# EAGLE board M.2 SoM breakout board v0.5 (EAGLE 9.6.2), part 1 of 2
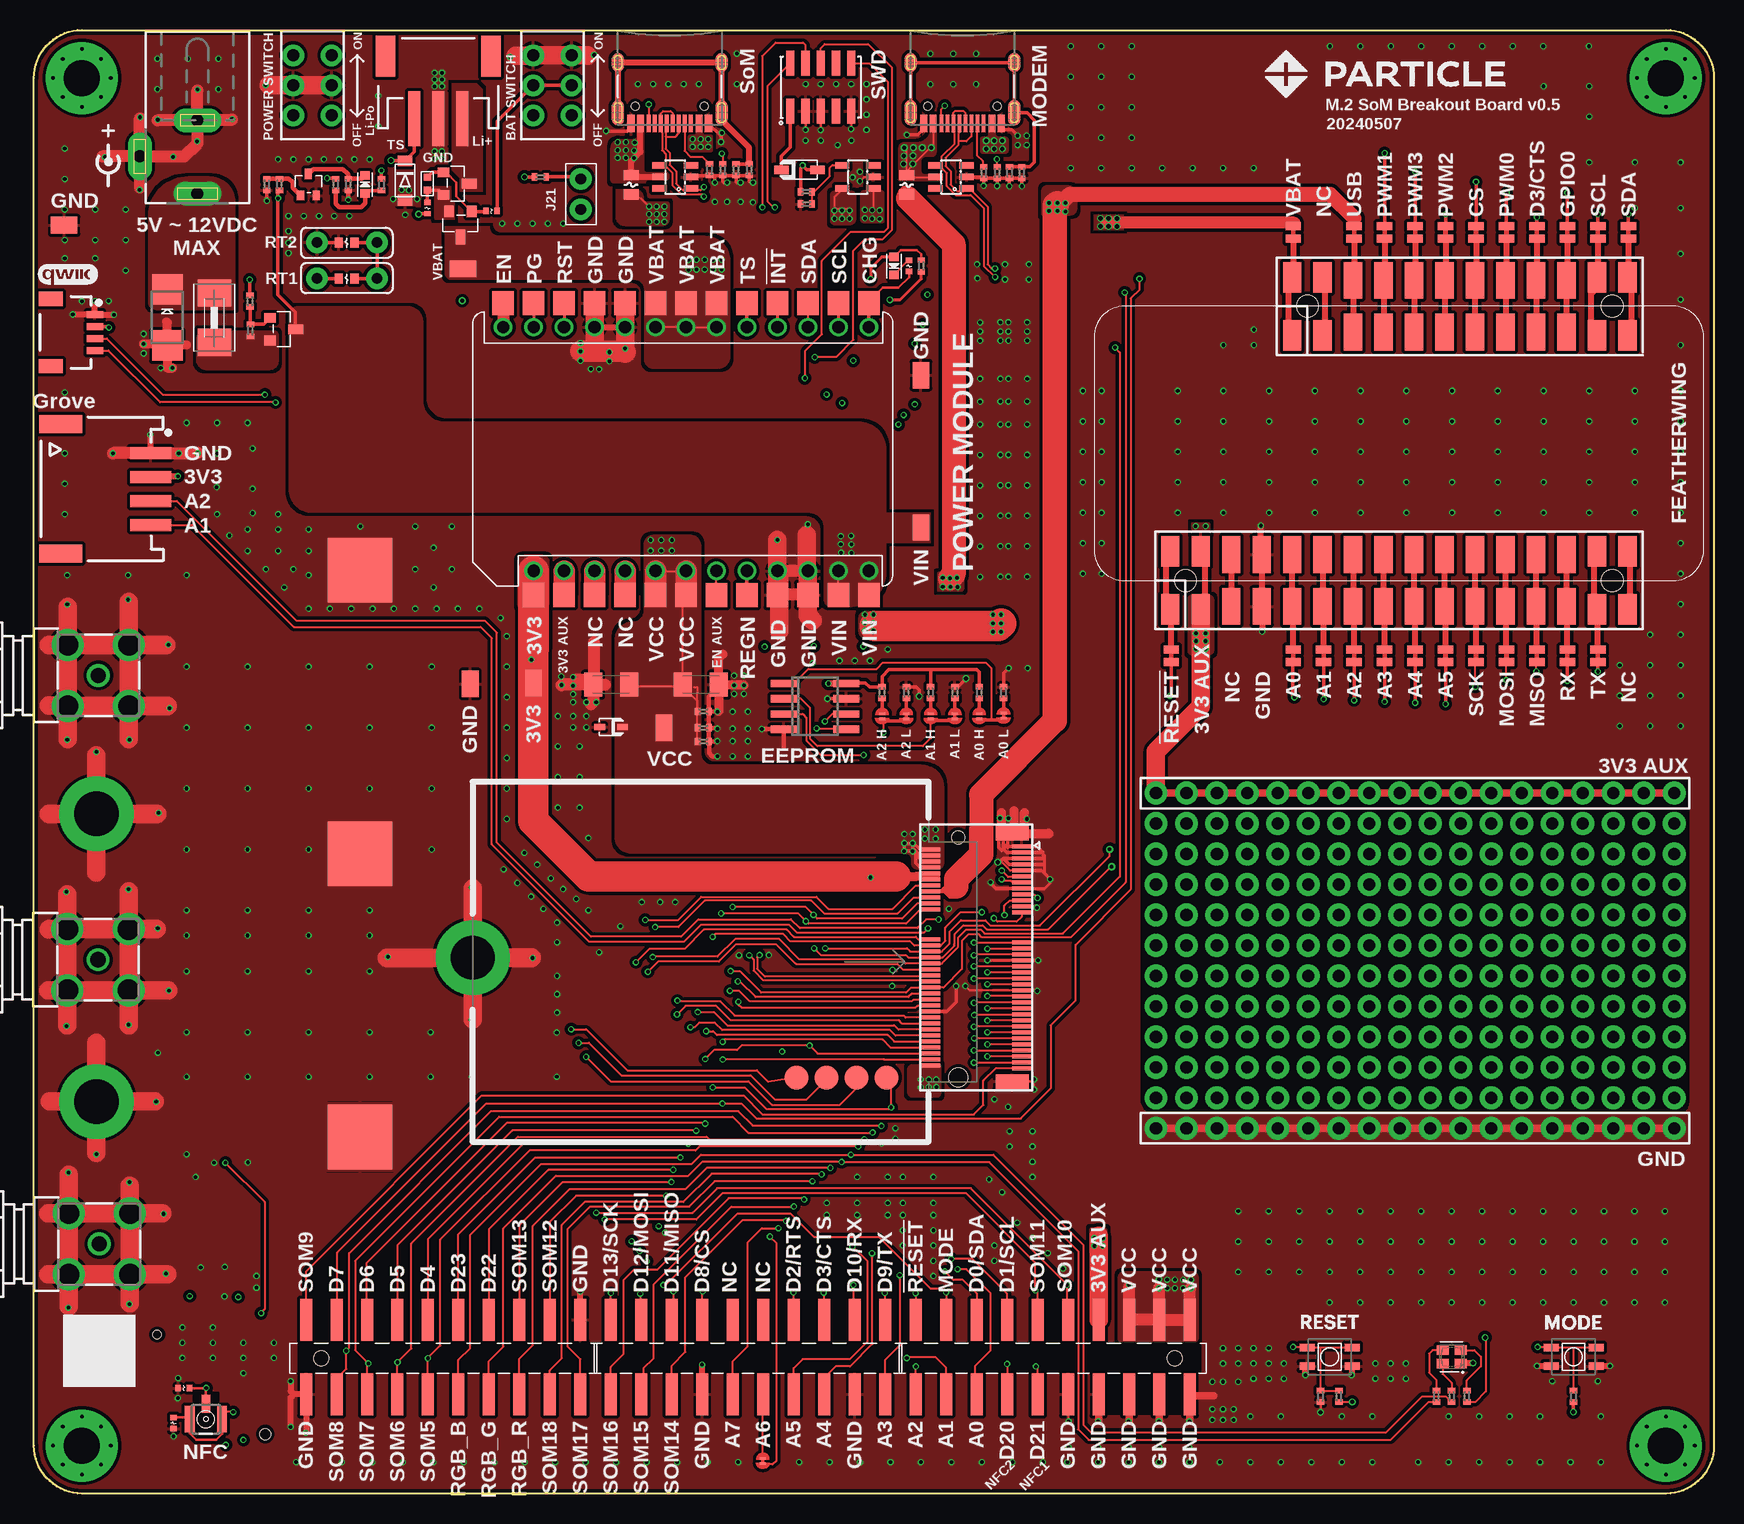
[diagram p3: board, top side]
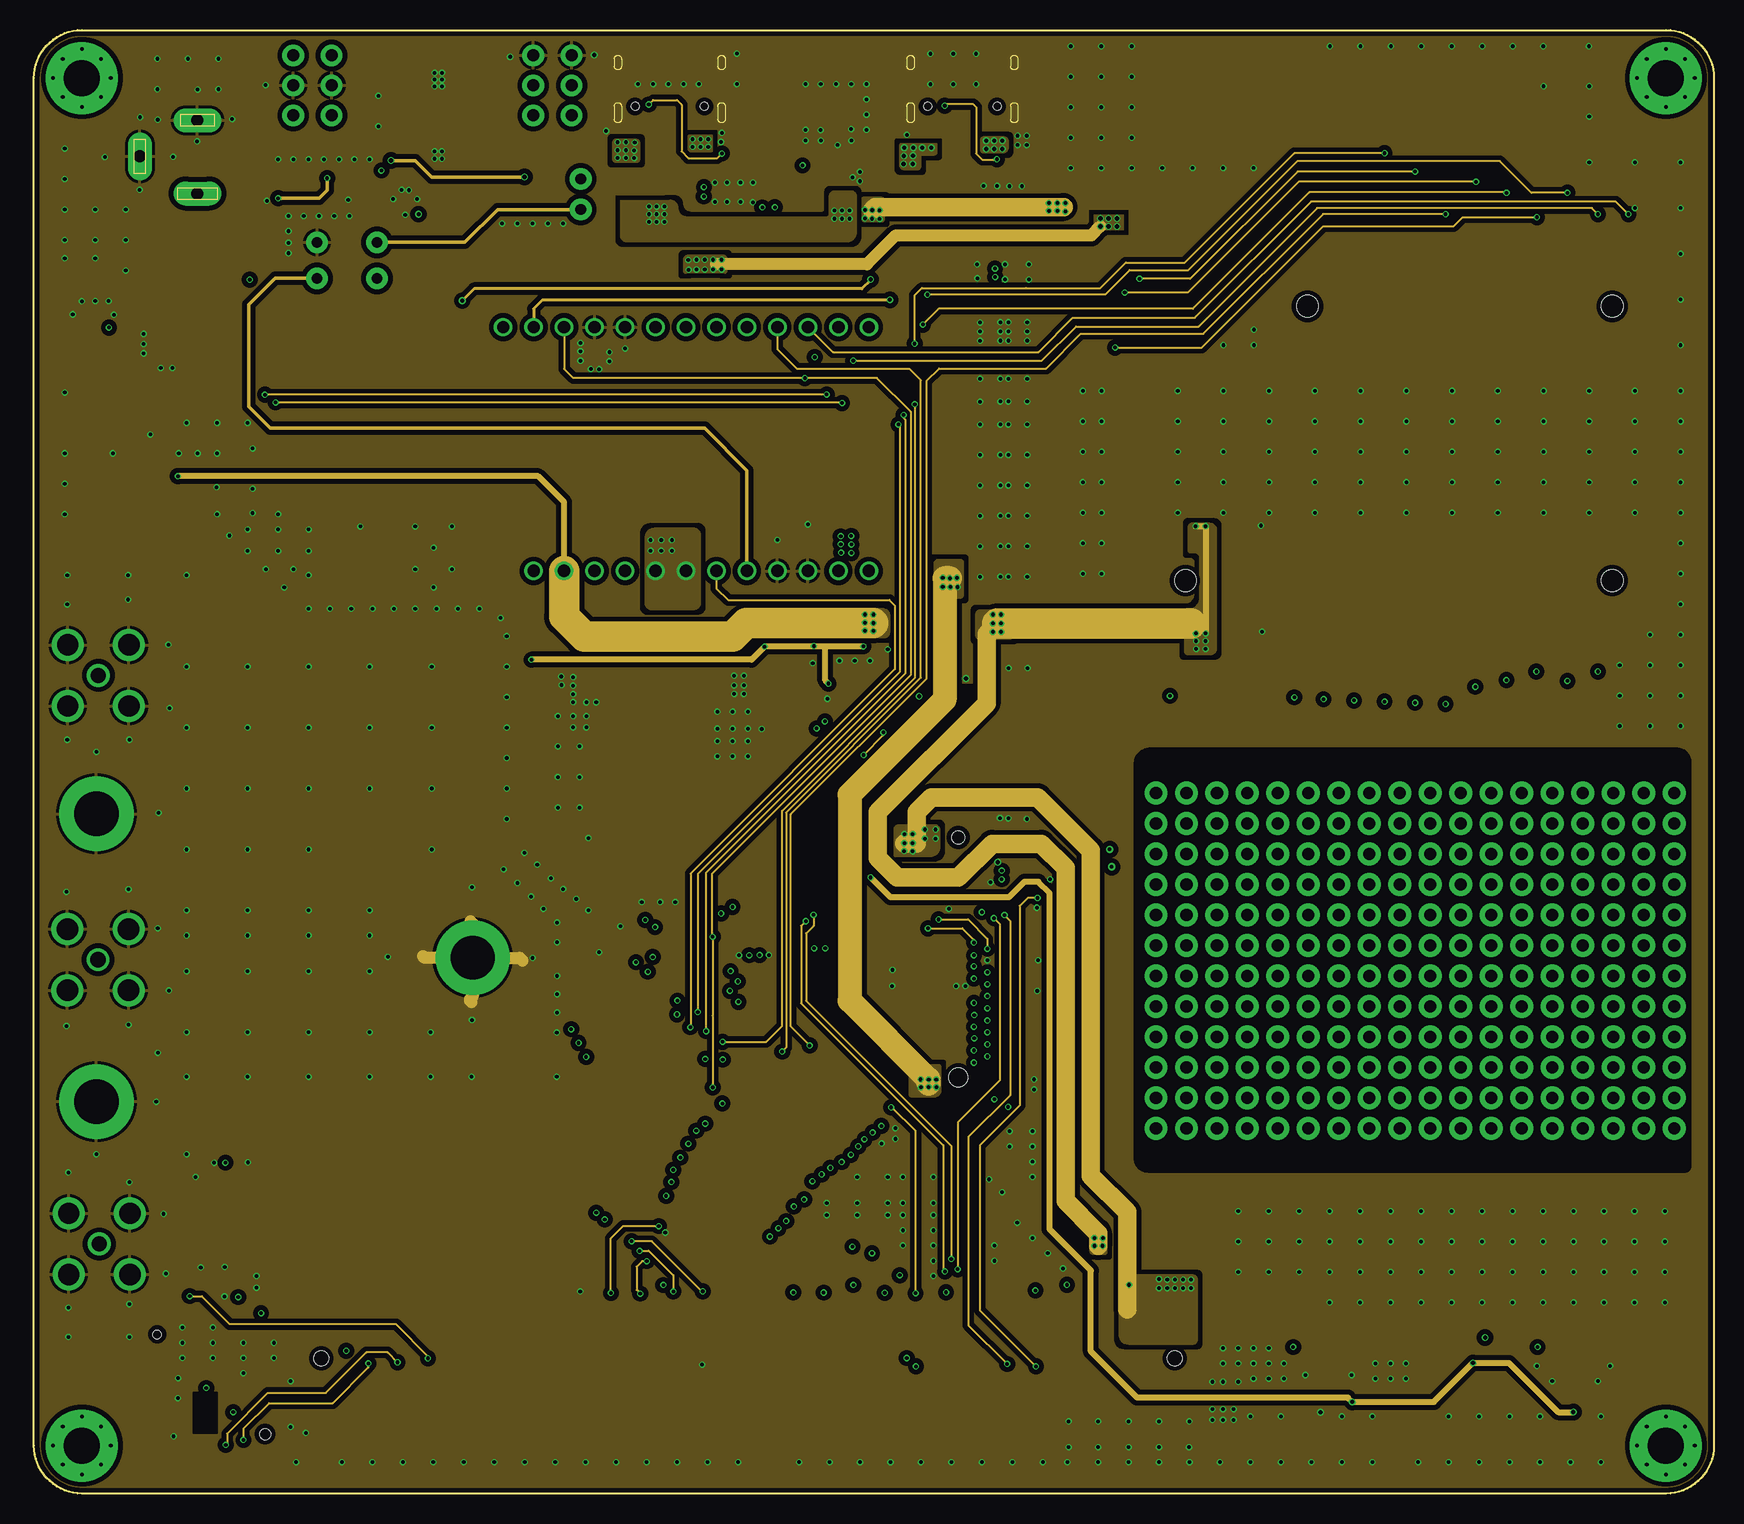
[diagram p4: board, inner layer VCC]
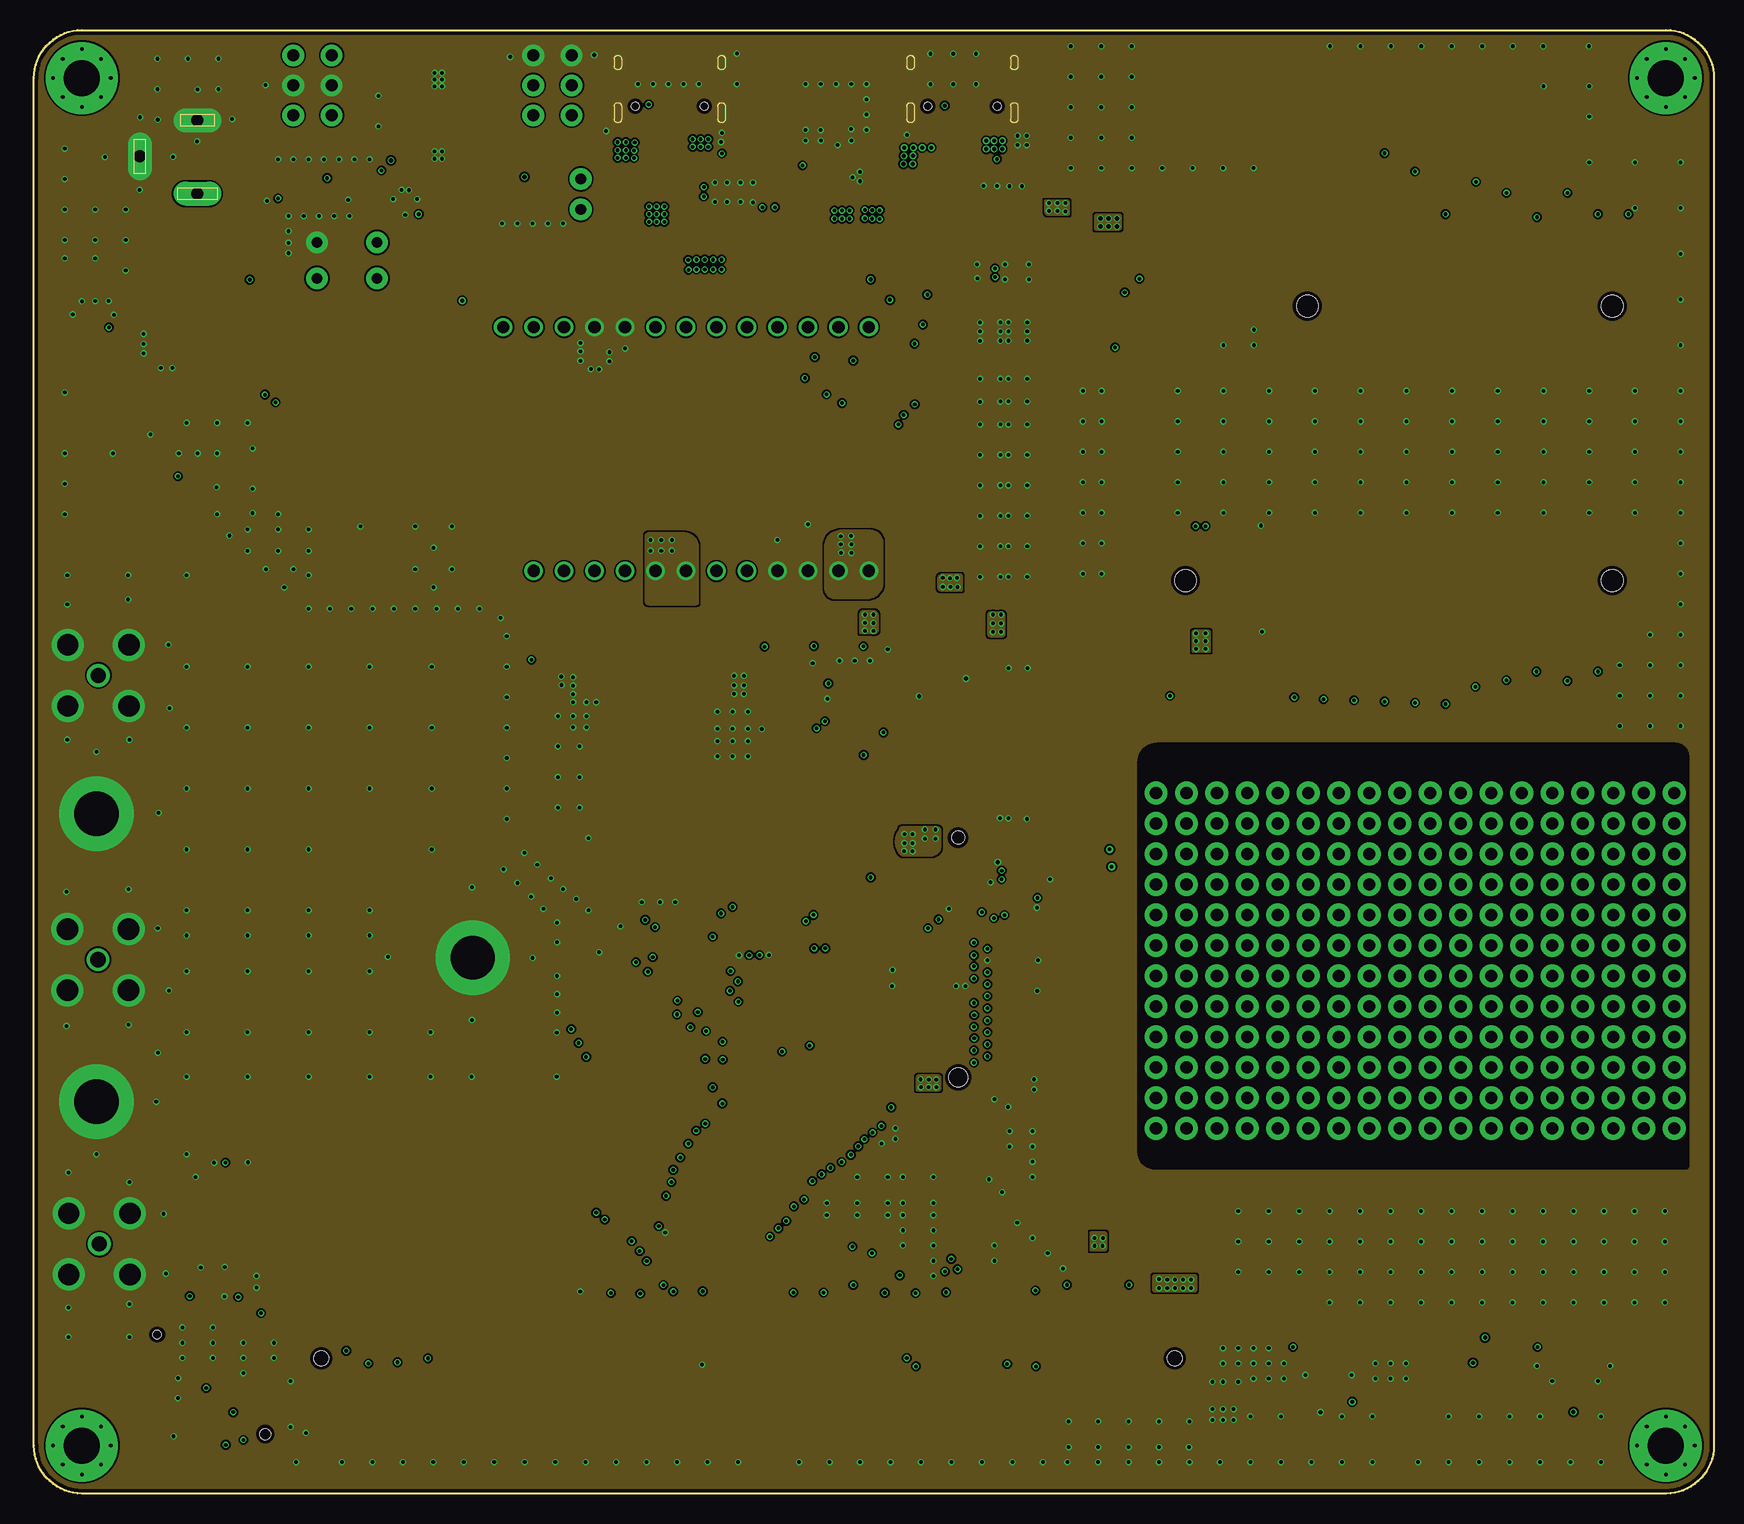
[diagram p5: board, inner layer GND]
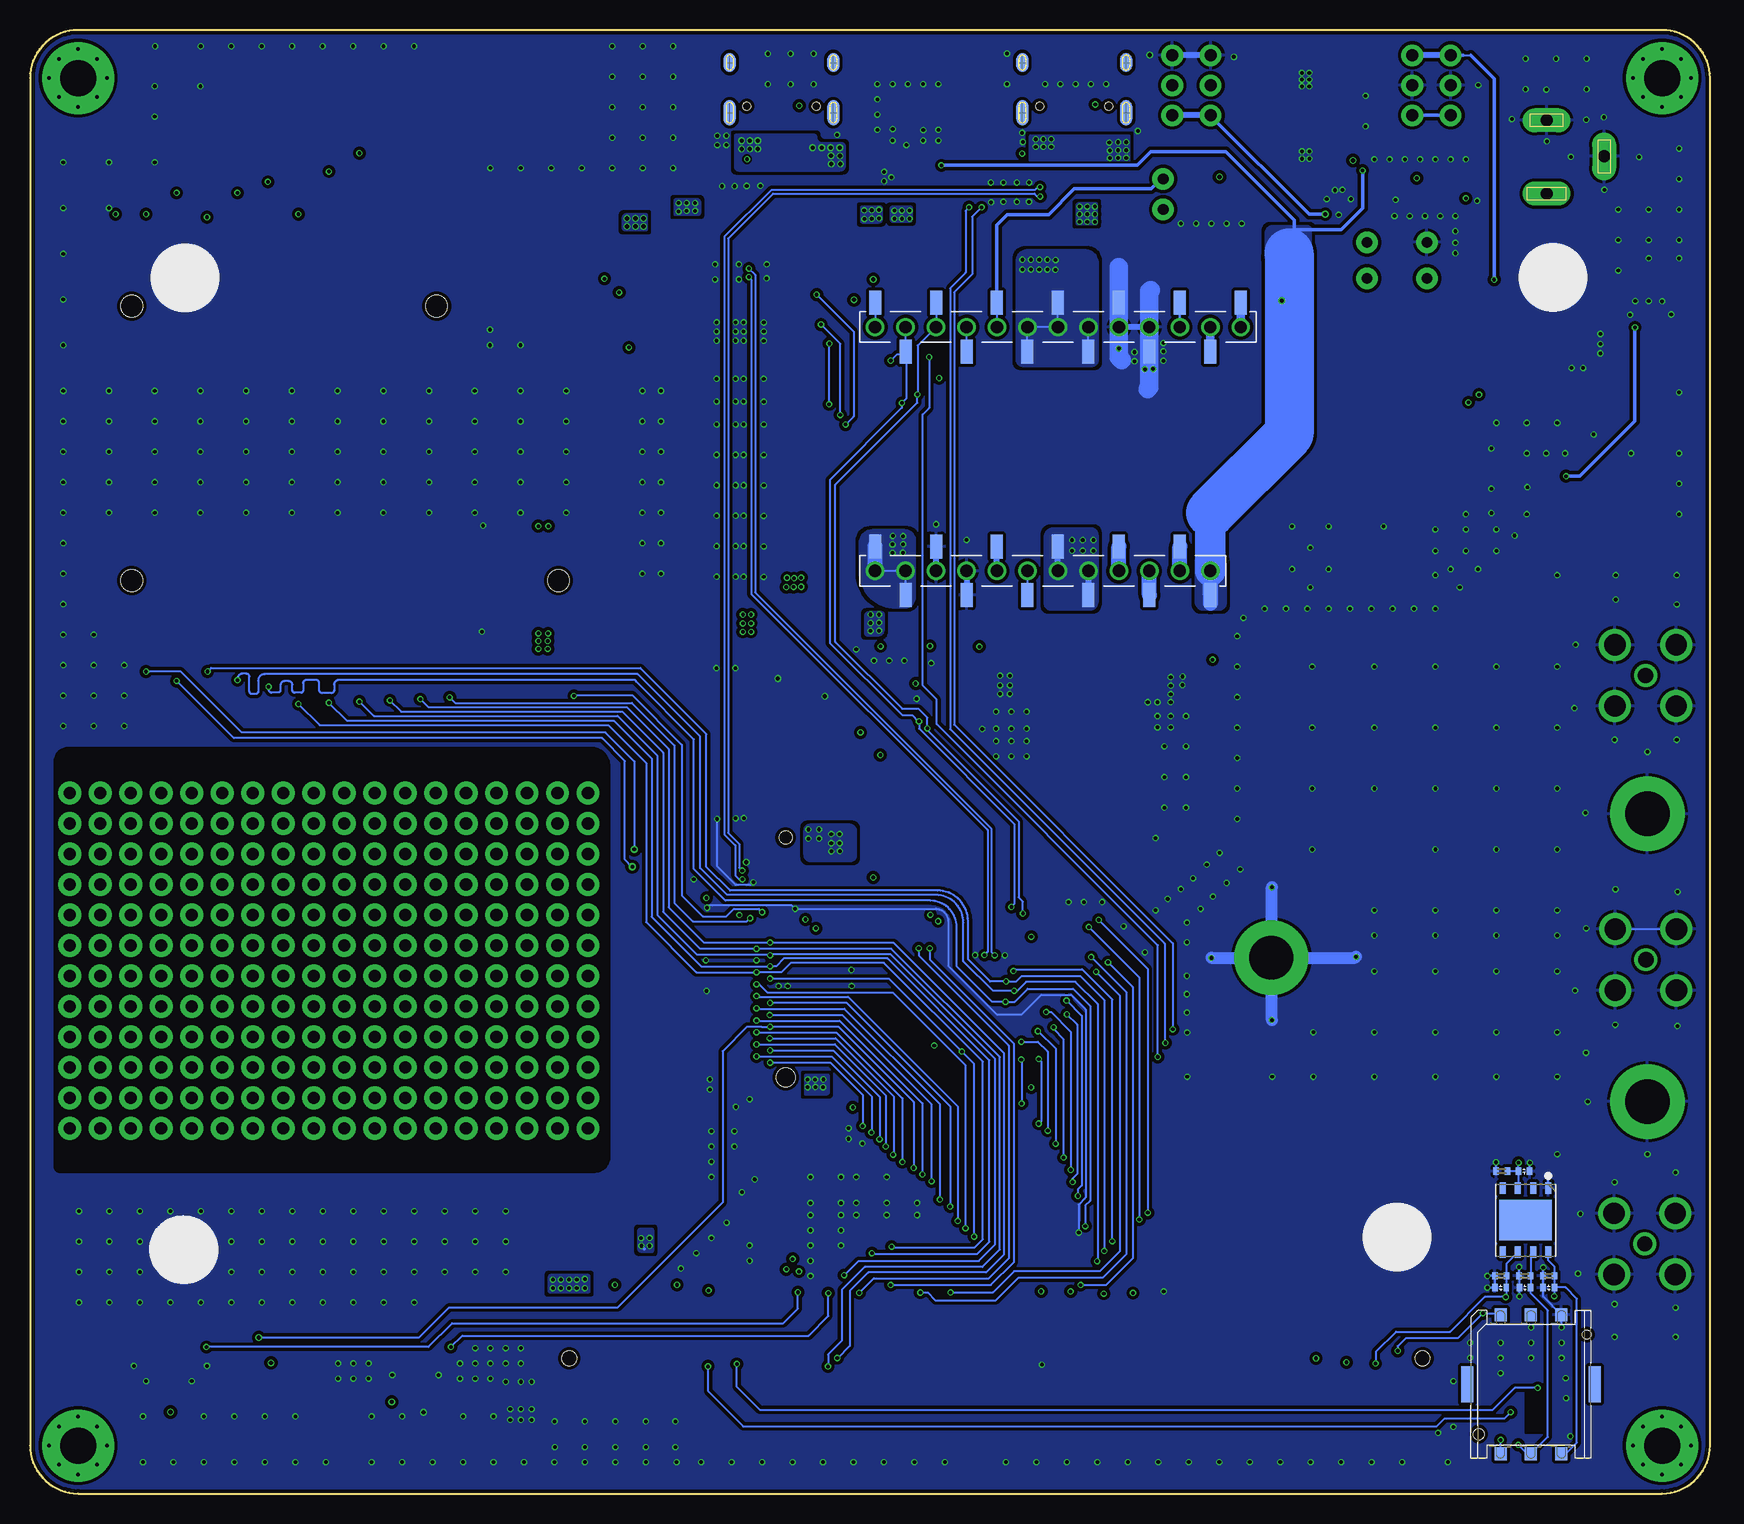
[diagram p6: board, bottom side, seen from below]

Size 140 x 122 mm. Coordinates in mm from the lower left corner, seen from the top.
Outline: 136,0 4,0 arc-90 0,4 0,118 arc-90 4,122 136,122 arc-90 140,118 140,4 arc-90 136,0
Copper layers (1+2*15+16): Top 0.035mm / dielectric 1.5mm / VCC 0.035mm / dielectric 0.15mm / GND 0.035mm / dielectric 0.2mm / Bottom 0.035mm
Design rules "default *": minimum track width 4mil, minimum drill 0.1mm, track to track 5mil, track to pad 5mil, pad to pad 5mil, via to via 5mil, smd to smd 5mil, copper to edge 12mil, drill to drill 6mil, minimum pad ring 4mil, minimum via ring 4mil, stop-mask expansion 0mil, vias tented up to drill 0.35mm, thermal gap 10mil
Net classes: 0 default: width 0.152 mm, drill 0.3 mm, clearance 0.152 mm; 1 power: width 0.254 mm, drill 0.61 mm, clearance 0.203 mm; 2 90R_Impedance: width 0.152 mm, drill 0.3 mm, clearance 0.152 mm; 3 BAT: clearance 0.203 mm

## Footprints (pad centres in the part's own frame; a part is rotated, then mirrored left to right if it is on the bottom)
S2751-46R = smd 2.2 x 1.4: 1 0,0
C0402_B = smd 0.457 x 0.61: 1 -0.483,0; 2 0.483,0
C1206K = smd 1.5 x 2: 1 -1.5,0; 2 1.5,0
SOT23-6 = smd 0.55 x 1.2: 1 -0.95,-1.3; 2 0,-1.3; 3 0.95,-1.3; 4 0.95,1.3; 5 0,1.3; 6 -0.95,1.3
SOD-123 = smd 1.2 x 0.7: 1 -1.5,0; 2 1.5,0
SOD-123FL = smd 0.91 x 1.22: A 1.637,0; C -1.637,0
C0402 = smd 0.45 x 0.6: 1 -0.47,0; 2 0.47,0
SOD-323 = smd 0.9 x 0.5: 1 -0.95,0; 2 0.95,0
SMADIODE = smd 2.54 x 2.54: A 2.349,0; C -2.349,0
F0805 = smd 0.85 x 1.25: P$1 -0.8,0; P$2 0.8,0
1812 = smd 2.286 x 2.794: 1 -2.046,0; 2 2.046,0
JST-3-SMD = smd 1 x 4.6: 1 -1.99,-4.77; 2 0.01,-4.77; 3 2.01,-4.77 | smd 1.6 x 3.4: NC1 -4.39,0.43; NC2 4.41,0.43
DCJ0202 = drill 1 pad 2 long: 1 0,3.1; 2 4.8,0; 3 0,-3
SPARK_CON_30X2_SMD = smd 1 x 3.5: 1 0,3.013; 2 0,-3.213; 3 2.54,3.013; 4 2.54,-3.213; 5 5.08,3.013; 6 5.08,-3.213; 7 7.62,3.013; 8 7.62,-3.213; 9 10.16,3.013; 10 10.16,-3.213; 11 12.7,3.013; 12 12.7,-3.213; 13 15.24,3.013; 14 15.24,-3.213; 15 17.78,3.013; 16 17.78,-3.213; 17 20.32,3.013; 18 20.32,-3.213; 19 22.86,3.013; 20 22.86,-3.213; 21 25.4,3.013; 22 25.4,-3.213; 23 27.94,3.013; 24 27.94,-3.213; 25 30.48,3.013; 26 30.48,-3.213; 27 33.02,3.013; 28 33.02,-3.213; 29 35.56,3.013; 30 35.56,-3.213; 31 38.1,3.013; 32 38.1,-3.213; 33 40.64,3.013; 34 40.64,-3.213; 35 43.18,3.013; 36 43.18,-3.213; 37 45.72,3.013; 38 45.72,-3.213; 39 48.26,3.013; 40 48.26,-3.213; 41 50.8,3.013; 42 50.8,-3.213; 43 53.34,3.013; 44 53.34,-3.213; 45 55.88,3.013; 46 55.88,-3.213; 47 58.42,3.013; 48 58.42,-3.213; 49 60.96,3.013; 50 60.96,-3.213; 51 63.5,3.013; 52 63.5,-3.213; 53 66.04,3.013; 54 66.04,-3.213; 55 68.58,3.013; 56 68.58,-3.213; 57 71.12,3.013; 58 71.12,-3.213; 59 73.66,3.013; 60 73.66,-3.213 | hole 1.2: 1.27,0; 72.39,0
1X04_1MM_RA = smd 0.6 x 1.35: 1 -1.5,0; 2 -0.5,0; 3 0.5,0; 4 1.5,0 | smd 1.2 x 2: NC1 2.8,-3.675; NC2 -2.8,-3.675
SCREW-HOLE-3.7 = drill 3.7 pad 6.2: P$1 0,0
M.2-SOM-BREAKOUT-BOARD-V0.2-0228_PARTICLE-SZ_PARTICLE-POWER-MODULE = smd 1 x 2 bottom: 1 5.08,-0.762; 2 7.62,3.302; 3 10.16,-0.762; 4 12.7,3.302; 5 15.24,-0.762; 6 17.78,3.302; 7 20.32,-0.762; 8 22.86,3.302; 9 25.4,-0.762; 10 27.94,3.302; 11 30.48,-0.762; 12 33.02,3.302; 13 33.02,23.622; 14 30.48,19.55; 15 27.94,23.622; 16 25.4,19.55; 17 22.86,23.622; 18 20.32,19.55; 19 17.78,23.622; 20 15.24,19.55; 21 12.7,23.622; 22 10.16,19.55; 23 7.62,23.622; 24 5.08,19.558; 25 2.54,23.622 | smd 1.8 x 2: @1 5.08,-0.762; @2 7.62,-0.73; @3 10.16,-0.762; @4 12.7,-0.73; @5 15.24,-0.762; @6 17.78,-0.73; @7 20.32,-0.762; @8 22.86,-0.73; @9 25.4,-0.762; @10 27.94,-0.73; @11 30.48,-0.762; @12 33.02,-0.73; @13 33.02,23.59; @14 30.48,23.59; @15 27.94,23.59; @16 25.4,23.59; @17 22.86,23.59; @18 20.32,23.59; @19 17.78,23.59; @20 15.24,23.59; @21 12.7,23.59; @22 10.16,23.59; @23 7.62,23.59; @24 5.08,23.59; @25 2.54,23.59 | drill 1.016 pad 1.524: P$1 5.08,1.27; P$2 7.62,1.27; P$3 10.16,1.27; P$4 12.7,1.27; P$5 15.24,1.27; P$6 17.78,1.27; P$7 20.32,1.27; P$8 22.86,1.27; P$9 25.4,1.27; P$10 27.94,1.27; P$11 30.48,1.27; P$12 33.02,1.27; P$13 33.02,21.59; P$14 30.48,21.59; P$15 27.94,21.59; P$16 25.4,21.59; P$17 22.86,21.59; P$18 20.32,21.59; P$19 17.78,21.59; P$20 15.24,21.59; P$21 12.7,21.59; P$22 10.16,21.59; P$23 7.62,21.59; P$24 5.08,21.59; P$25 2.54,21.59
M.2-SOM-BREAKOUT-BOARD-V0.2-0228_WAFER-HY2.0-4PWB = smd 1 x 3.4: 1 -3,3.7; 2 -1,3.7; 3 1,3.7; 4 3,3.7 | smd 1.5 x 3.6: NC1 5.4,-3.8; NC2 -5.4,-3.8
TP_OPEN = smd 0.2 x 0.5: 1 -0.21,0; 2 0.21,0
GCT-SIM8100 = smd 1 x 1.1: C1 2.54,-5.8; C2 0,-5.8; C3 -2.54,-5.8; C5 2.54,5.8; C6 0,5.8; C7 -2.54,5.8 | smd 1 x 3: NC@1 -5.3,0; NC@2 5.3,0 | hole 0.7: 4.65,4.15 | hole 0.9: -4.35,-4.15
PARTICLE-STUDIOS_PARTICLE_M.2EKEY_3.65MM_DRILL = smd 0.3 x 1.55: 1 -9.62,3.735; 2 -9.37,-3.815; 3 -9.12,3.735; 4 -8.87,-3.815; 5 -8.62,3.735; 6 -8.37,-3.815; 7 -8.12,3.735; 8 -7.87,-3.815; 9 -7.62,3.735; 10 -7.37,-3.815; 11 -7.12,3.735; 12 -6.87,-3.815; 13 -6.62,3.735; 14 -6.37,-3.815; 15 -6.12,3.735; 16 -5.87,-3.815; 17 -5.62,3.735; 18 -5.37,-3.815; 19 -5.12,3.735; 20 -4.87,-3.815; 21 -4.62,3.735; 22 -4.37,-3.815; 23 -4.12,3.735; 32 -1.87,-3.815; 33 -1.62,3.735; 34 -1.37,-3.815; 35 -1.12,3.735; 36 -0.87,-3.815; 37 -0.62,3.735; 38 -0.37,-3.815; 39 -0.12,3.735; 40 0.13,-3.815; 41 0.38,3.735; 42 0.63,-3.815; 43 0.88,3.735; 44 1.13,-3.815; 45 1.38,3.735; 46 1.63,-3.815; 47 1.88,3.735; 48 2.13,-3.815; 49 2.38,3.735; 50 2.63,-3.815; 51 2.88,3.735; 52 3.13,-3.815; 53 3.38,3.735; 54 3.63,-3.815; 55 3.88,3.735; 56 4.13,-3.815; 57 4.38,3.735; 58 4.63,-3.815; 59 4.88,3.735; 60 5.13,-3.815; 61 5.38,3.735; 62 5.63,-3.815; 63 5.88,3.735; 64 6.13,-3.815; 65 6.38,3.735; 66 6.63,-3.815; 67 6.88,3.735; 68 7.13,-3.815; 69 7.38,3.735; 70 7.63,-3.815; 71 7.88,3.735; 72 8.13,-3.815; 73 8.38,3.735; 74 8.63,-3.815; 75 8.88,3.735 | smd 1.2 x 2.75: 76 9.98,2.96; 77 -10.72,2.96 | drill 3.65 pad 6.2: 78 -0.351,-42 | smd 2 x 2: !RESET 9.63,-7.5; SWCLK 9.63,-15; SWDIO 9.63,-12.5; SWO 9.63,-10 | hole 1.1: -10.37,-1.54 | hole 1.55: 9.63,-1.54
SIP-2 = drill 0.9 pad 1.8: 1 -1.27,0; 2 1.27,0
TP_SHORT = smd 0.2 x 0.5: 1 -0.21,0; 2 0.21,0
SMT-JUMPER_2_NC_TRACE_NO-SILK = smd 0.66 x 1.27: 1 -0.521,0; 2 0.521,0
CONN5X2_1.27 = smd 0.7 x 2.1: 1 -2.54,-2; 2 -2.54,2; 3 -1.27,-2; 4 -1.27,2; 5 0,-2; 6 0,2; 7 1.27,-2; 8 1.27,2; 9 2.54,-2; 10 2.54,2
LED0603 = smd 0.7 x 0.8: 1 -0.75,0; 2 0.75,0
TACTILE_SWITCH_SMD = smd 1.25 x 0.65: 1 -1.875,0.775; 2 1.875,0.775; 3 -1.875,-0.775; 4 1.875,-0.775
FEATHERWING_SMT2 = smd 1.524 x 2.54: 1 6.35,2.413; 1' 6.35,-2.413; 2 8.89,2.413; 2' 8.89,-2.413; 15 41.91,2.413; 15' 41.91,-2.413; 16 44.45,2.413; 16' 44.45,-2.413; 17 44.45,20.447; 17' 44.45,25.273; 18 41.91,20.447; 18' 41.91,25.273; 27 19.05,20.447; 27' 19.05,25.273; 28 16.51,20.447; 28' 16.51,25.273 | smd 1.524 x 3.048: 3 11.43,2.159; 3' 11.43,-2.159; 4 13.97,2.159; 4' 13.97,-2.159; 5 16.51,2.159; 5' 16.51,-2.159; 6 19.05,2.159; 6' 19.05,-2.159; 7 21.59,2.159; 7' 21.59,-2.159; 8 24.13,2.159; 8' 24.13,-2.159; 9 26.67,2.159; 9' 26.67,-2.159; 10 29.21,2.159; 10' 29.21,-2.159; 11 31.75,2.159; 11' 31.75,-2.159; 12 34.29,2.159; 12' 34.29,-2.159; 13 36.83,2.159; 13' 36.83,-2.159; 14 39.37,2.159; 14' 39.37,-2.159; 19 39.37,20.701; 19' 39.37,25.019; 20 36.83,20.701; 20' 36.83,25.019; 21 34.29,20.701; 21' 34.29,25.019; 22 31.75,20.701; 22' 31.75,25.019; 23 29.21,20.701; 23' 29.21,25.019; 24 26.67,20.701; 24' 26.67,25.019; 25 24.13,20.701; 25' 24.13,25.019; 26 21.59,20.701; 26' 21.59,25.019 | hole 1.8: 17.78,22.86; 43.18,22.86; 7.62,0; 43.18,0
IPEX-20279-001E = smd 0.73 x 1.5: 1 0,1.28 | smd 0.8 x 2.2: 2@1 -1.35,0; 2@2 1.35,0
SOT323 = smd 0.6 x 0.8: 1 -0.65,-0.95; 2 0.65,-0.95 | smd 0.6 x 0.9: 3 0,0.85
SOT-23 = smd 0.8 x 0.95: 1 -0.95,-1; 2 0.95,-1 | smd 0.8 x 1.25: 3 0,1.15
R0402_B = smd 0.457 x 0.61: 1 -0.483,0; 2 0.483,0
R-0402S = smd 0.45 x 0.55: 1 -0.47,0; 2 0.47,0
R0603 = smd 0.6 x 0.6: 1 -0.55,0; 2 0.55,0
PLCC4-2MM-RGB = smd 1 x 0.8: BLUE -0.75,-0.55; CA 0.75,-0.55; GREEN -0.75,0.55; RED 0.75,0.55
R-0603A = smd 0.7 x 0.85: 1 -0.65,0; 2 0.65,0
SWITCH-2.5X3.2-6 = drill 1 pad 1.8: 1 0,0; 2 0,2.5; 3 0,5; 4 3.2,0; 5 3.2,2.5; 6 3.2,5
TPEB = drill 0.9 pad 1.8: 1 0,0
SOT25 = smd 0.55 x 1.2: 1 -0.95,-1.3; 2 0,-1.3; 3 0.95,-1.3; 4 0.95,1.3; 5 -0.95,1.3
SO-08 = smd 0.6 x 2.2: 1 -1.905,-2.6; 2 -0.635,-2.6; 3 0.635,-2.6; 4 1.905,-2.6; 5 1.905,2.6; 6 0.635,2.6; 7 -0.635,2.6; 8 -1.905,2.6
MFF2 = smd 0.96 x 0.5: 1 -2.675,1.905; 2 -2.675,0.635; 3 -2.675,-0.635; 4 -2.675,-1.905; 5 2.675,-1.905; 6 2.675,-0.635; 7 2.675,0.635; 8 2.675,1.905 | smd 3.4 x 4.4: P$1 0,0
USB-C-16P = smd 0.3 x 1.45: A5 -1.25,0; A6 -0.25,0; A7 0.25,0; A8 1.25,0; B5 1.75,0; B6 0.75,0; B7 -0.75,0; B8 -1.75,0 | smd 0.6 x 1.45: GND -3.225,0; GND2 3.225,0 | smd 1 x 2.1: SHLD1 -4.32,-0.915; SHLD2 4.32,-0.915 | smd 1 x 2.1 bottom: SHLD3 -4.32,-0.915; SHLD4 4.32,-0.915 | smd 1 x 1.6: SHLD5 -4.32,-5.095; SHLD8 4.32,-5.095 | smd 1 x 1.6 bottom: SHLD6 -4.32,-5.095; SHLD7 4.32,-5.095 | smd 0.55 x 1.45: VBUS1 -2.45,0; VBUS2 2.45,0 | hole 0.65: -2.89,-1.445; 2.89,-1.445
BU-SMA-G = drill 1.27: 1 0,0 | drill 1.778: 2 -2.55,2.55; 3 2.55,2.55; 4 2.55,-2.55; 5 -2.55,-2.55
S8111-46R = smd 5.4 x 5.4: C 0,0

## Placement (x,y rotation side)
3V3  [S2751-46R]  41.63,67.53 90 top
C1  0.1uF  [C0402_B]  107.22,8.1 270 top
C2  0.1uF  [C0402_B]  82.32,110.11 270 top
C3  0.1uF  [C0402_B]  59.61,110.34 270 top
C4  33pF  [C0402_B]  15.43,18.15 180 bottom
C5  33pF  [C0402_B]  17.35,26.87 180 bottom
C6  33pF  [C0402_B]  17.45,18.15 180 bottom
C7  0.1uF  [C0402_B]  13.43,18.15 180 bottom
C8  1nF  [C0402_B]  55.77,65.18 0 top
C9  100pF  [C0402_B]  55.77,62.69 0 top
C10  33pF  [C0402_B]  55.77,63.82 0 top
C20  100uF  [C1206K]  55.57,67.42 0 top
C61  100uF  [C1206K]  48.09,67.42 180 top
D1  TPESD0504S6  [SOT23-6]  53.44,109.74 90 top
D2  B5819w  [SOD-123]  63.78,110.34 180 top
D4  SMF3.3  [SOD-123FL]  30.93,109.44 270 top
D7  0402ESDA-05N  [C0402]  13.43,17.16 0 bottom
D11  0402ESDA-05N  [C0402]  17.45,17.16 0 bottom
D12  0402ESDA-05N  [C0402]  15.5,26.87 180 bottom
D13  0402ESDA-05N  [C0402]  15.42,17.16 0 bottom
D16  PZ3D4V2H  [SOD-323]  48.09,63.89 0 top
D17  SMAJ15CA-13-F  [SMADIODE]  11.11,98.04 270 top
D23  DNP MAX3207EAUT+T  [SOT23-6]  76.42,109.74 90 top
F2  RF1512-000  [F0805]  49.76,109.09 270 top
F4  Fuse  [F0805]  72.71,109.09 90 top
F5  16V/0.75A  [1812]  15.03,98.02 270 top
GND  [S2751-46R]  2.51,105.72 180 top
GND15  [S2751-46R]  36.35,67.49 90 top
GND18  [S2751-46R]  73.91,93.22 90 top
J1  3-PIN SMD  [JST-3-SMD]  33.68,119.38 0 top
J2  DCJ0202  [DCJ0202]  13.62,111.46 180 top
J3  SPARK_CON_30X2_SMD  [SPARK_CON_30X2_SMD]  96.33,11.27 180 top
J4  [1X04_1MM_RA]  5.09,96.78 270 top
J5  SCREW-HOLE-3.7  [SCREW-HOLE-3.7]  5.21,56.66 0 top
J6  M.2-SOM-BREAKOUT-BOARD-V0.2-0228_PARTICLE-SZ_PARTICLE-POWER-MODULE  [M.2-SOM-BREAKOUT-BOARD-V0.2-0228_PARTICLE-SZ_PARTICLE-POWER-MODULE]  36.56,75.64 0 top
J7  SCREW-HOLE-3.7  [SCREW-HOLE-3.7]  5.21,32.68 0 top
J11  WAFER-HY2.0-4PWB  [M.2-SOM-BREAKOUT-BOARD-V0.2-0228_WAFER-HY2.0-4PWB]  6.02,83.74 270 top
J12  TP_OPEN  [TP_OPEN]  70.67,64.79 270 top
J13  SIM-NANO-4FF  [GCT-SIM8100]  14.92,9.11 0 bottom
J18  PARTICLE-STUDIOS_M_SERIES_M.2KEY  [PARTICLE-STUDIOS_PARTICLE_M.2EKEY_3.65MM_DRILL]  78.56,44.31 270 top
J19  TP_OPEN  [TP_OPEN]  74.72,64.79 270 top
J20  TP_OPEN  [TP_OPEN]  78.78,64.79 270 top
J21  SIP-2  [SIP-2]  45.57,108.31 270 top
JP1  TP_SHORT  [TP_SHORT]  72.7,64.79 270 top
JP2  TP_SHORT  [TP_SHORT]  76.75,64.79 270 top
JP3  TP_SHORT  [TP_SHORT]  80.8,64.83 270 top
JP4  TP_SHORT  [TP_SHORT]  60.74,2.71 270 top
JP5  JUMPER-SMT_2_NC_TRACE_NO-SILK  [SMT-JUMPER_2_NC_TRACE_NO-SILK]  94.77,69.82 90 top
JP6  JUMPER-SMT_2_NC_TRACE_NO-SILK  [SMT-JUMPER_2_NC_TRACE_NO-SILK]  104.93,69.82 90 top
JP7  JUMPER-SMT_2_NC_TRACE_NO-SILK  [SMT-JUMPER_2_NC_TRACE_NO-SILK]  107.47,69.82 90 top
JP8  JUMPER-SMT_2_NC_TRACE_NO-SILK  [SMT-JUMPER_2_NC_TRACE_NO-SILK]  110.01,69.82 90 top
JP9  JUMPER-SMT_2_NC_TRACE_NO-SILK  [SMT-JUMPER_2_NC_TRACE_NO-SILK]  112.55,69.82 90 top
JP10  JUMPER-SMT_2_NC_TRACE_NO-SILK  [SMT-JUMPER_2_NC_TRACE_NO-SILK]  115.09,69.82 90 top
JP11  JUMPER-SMT_2_NC_TRACE_NO-SILK  [SMT-JUMPER_2_NC_TRACE_NO-SILK]  117.63,69.82 90 top
JP12  JUMPER-SMT_2_NC_TRACE_NO-SILK  [SMT-JUMPER_2_NC_TRACE_NO-SILK]  120.17,69.82 90 top
JP13  JUMPER-SMT_2_NC_TRACE_NO-SILK  [SMT-JUMPER_2_NC_TRACE_NO-SILK]  122.71,69.82 90 top
JP14  JUMPER-SMT_2_NC_TRACE_NO-SILK  [SMT-JUMPER_2_NC_TRACE_NO-SILK]  125.25,69.82 90 top
JP15  JUMPER-SMT_2_NC_TRACE_NO-SILK  [SMT-JUMPER_2_NC_TRACE_NO-SILK]  127.79,69.82 90 top
JP16  JUMPER-SMT_2_NC_TRACE_NO-SILK  [SMT-JUMPER_2_NC_TRACE_NO-SILK]  130.33,69.82 90 top
JP17  JUMPER-SMT_2_NC_TRACE_NO-SILK  [SMT-JUMPER_2_NC_TRACE_NO-SILK]  104.93,105.12 90 top
JP19  JUMPER-SMT_2_NC_TRACE_NO-SILK  [SMT-JUMPER_2_NC_TRACE_NO-SILK]  110.01,105.12 90 top
JP20  JUMPER-SMT_2_NC_TRACE_NO-SILK  [SMT-JUMPER_2_NC_TRACE_NO-SILK]  112.55,105.12 90 top
JP21  JUMPER-SMT_2_NC_TRACE_NO-SILK  [SMT-JUMPER_2_NC_TRACE_NO-SILK]  115.09,105.12 90 top
JP22  JUMPER-SMT_2_NC_TRACE_NO-SILK  [SMT-JUMPER_2_NC_TRACE_NO-SILK]  117.63,105.12 90 top
JP23  JUMPER-SMT_2_NC_TRACE_NO-SILK  [SMT-JUMPER_2_NC_TRACE_NO-SILK]  120.17,105.12 90 top
JP24  JUMPER-SMT_2_NC_TRACE_NO-SILK  [SMT-JUMPER_2_NC_TRACE_NO-SILK]  122.71,105.12 90 top
JP25  JUMPER-SMT_2_NC_TRACE_NO-SILK  [SMT-JUMPER_2_NC_TRACE_NO-SILK]  125.25,105.12 90 top
JP26  JUMPER-SMT_2_NC_TRACE_NO-SILK  [SMT-JUMPER_2_NC_TRACE_NO-SILK]  127.79,105.12 90 top
JP27  JUMPER-SMT_2_NC_TRACE_NO-SILK  [SMT-JUMPER_2_NC_TRACE_NO-SILK]  130.33,105.12 90 top
JP28  JUMPER-SMT_2_NC_TRACE_NO-SILK  [SMT-JUMPER_2_NC_TRACE_NO-SILK]  132.87,105.12 90 top
JTAG  CONN5X2  [CONN5X2_1.27]  65.57,117.22 0 top
LED1  RED  [LED0603]  27.59,109.12 90 top
LED3  yellow  [LED0603]  71.66,102.33 270 top
LOGO2  QWIIC_LOGO_5MM  [QWIIC_5MM]  2.8,101.66 0 top
MODE  [TACTILE_SWITCH_SMD]  128.3,11.4 180 top
MS1  PARTICLE_MESH_SMTDUAL  [FEATHERWING_SMT2]  88.34,76.11 0 top
NFC  UFL  [IPEX-20279-001E]  14.33,6.2 0 top
Q1  L2N7002  [SOT323]  22.87,109.14 0 top
Q3  HSS2333  [SOT-23]  35.53,105.87 180 top
Q4  HSS2333  [SOT-23]  20.66,97.05 270 top
Q5  HSS2333  [SOT-23]  35.14,109.19 270 top
R1  5.1k  [R0402_B]  79.15,110.11 270 top
R2  1K  [R0402_B]  64.37,108.51 180 top
R3  5.1k  [R0402_B]  80.27,110.11 270 top
R4  10K  [R0402_B]  108.74,8.1 270 top
R5  1M  [R0402_B]  81.29,110.11 270 top
R6  5.1k  [R0402_B]  56.3,110.34 270 top
R7  1M  [R0402_B]  64.37,107.49 180 top
R8  1K  [R0402_B]  118.14,8.1 90 top
R9  5.1k  [R0402_B]  57.4,110.34 270 top
R10  1M  [R0402_B]  58.51,110.34 270 top
R11  1K/NC  [R0402_B]  20.45,109.12 270 top
R12  DNP  [R0402_B]  128.3,8.1 270 top
R13  1K  [R-0402S]  72.93,102.33 270 top
R14  100K  [R0402_B]  18.03,96.96 270 top
R15  1K  [R0402_B]  18.01,99.41 270 top
R16  1K/NC  [R0402_B]  28.96,109.09 270 top
R17  100K/NC  [R0402_B]  19.41,109.12 90 top
R18  10K  [R0402_B]  25.15,109.12 90 top
R19  1K  [R0402_B]  116.87,8.1 90 top
R20  1K  [R0402_B]  119.41,8.1 90 top
R21  1M/NC  [R0402_B]  73.94,102.33 90 top
R22  0R  [R0402_B]  26.19,109.12 90 top
R23  0R  [R0402_B]  42.21,109.74 180 top
R24  10K  [R0402_B]  70.67,66.76 90 top
R25  10K  [R0402_B]  74.72,66.76 90 top
R26  10K  [R0402_B]  78.78,66.76 90 top
R27  100K  [R0402_B]  72.7,66.76 90 top
R28  100K  [R0402_B]  76.75,66.76 90 top
R29  100K  [R0402_B]  80.8,66.76 90 top
R30  100K  [R0603]  32.79,109.19 270 top
R31  1K  [R-0402S]  38.13,106.9 0 top
R33  1K  [R-0402S]  32.79,107.16 90 top
R37  ESD NC  [R-0402S]  11.62,5.87 270 top
R38  ESD NC  [R-0402S]  12.48,8.78 0 top
RESET  [TACTILE_SWITCH_SMD]  107.98,11.4 180 top
RGB  RGB-LED-CLMVB-FKARGB  [PLCC4-2MM-RGB]  118.14,11.4 0 top
RT1  6.91K  [R-0603A]  26.05,101.27 180 top
RT2  83.2K  [R-0603A]  26.05,104.27 0 top
S1  [SWITCH-2.5X3.2-6]  21.61,114.89 0 top
S4  [SWITCH-2.5X3.2-6]  41.61,114.89 0 top
TP1  TPTPEB  [TPEB]  23.59,101.3 90 top
TP2  TPTPEB  [TPEB]  28.59,101.3 90 top
TP5  TPTPEB  [TPEB]  28.59,104.3 90 top
TP8  TPTPEB  [TPEB]  23.59,104.3 90 top
U1  XC8107  [SOT25]  68.65,109.74 90 top
U2  AT24CS64-SSHM-B  [SO-08]  65.09,65.62 270 top
U7  NC  [MFF2]  15.37,22.79 270 bottom
U$6  PARTICLE-LOGO  [PARTICLE-LOGO]  127.28,118.19 0 bottom
USB1  [USB-C-16P]  52.98,114.19 180 top
USB2  [USB-C-16P]  77.37,114.19 180 top
VBAT  [S2751-46R]  35.76,102.08 0 top
VCC  [S2751-46R]  52.5,63.85 90 top
VIN  [S2751-46R]  73.91,80.52 90 top
X1  BU-SMA-G  [BU-SMA-G]  5.44,20.81 180 top
X2  BU-SMA-G  [BU-SMA-G]  5.37,68.19 180 top
X3  BU-SMA-G  [BU-SMA-G]  5.34,44.5 180 top
X4  S8111-46R  [S8111-46R]  27.18,76.96 90 top
X5  S8111-46R  [S8111-46R]  27.18,53.34 90 top
X6  S8111-46R  [S8111-46R]  27.18,29.72 90 top

## Tracks (layer width: path | path; a pad name or v marks a point on that pad's centre or on a via)
3V3_AUX  (via drill 0.3 pad 0.5, 1.02 pad 1.91)
  Top 0.152: MS1.2 97.67,78.09 97.67,77.74 | 97.31,73.96 97.31,73.3 97.31,72.99
  Top 0.305: J4.2 6.17,97.28 v6.25,97.2 | 97.62,73.61 97.31,73.3 | MS1.2 97.62,78.14
  Top 0.5: 97.23,73.79 97.61,74.18 97.61,78.11 97.23,78.5 MS1.2
  Top 0.508: MS1.2' 97.23,73.79 97.67,74.23 | 97.67,77.74 97.67,78.96 | J11.2 9.79,84.8 v11.99,84.8 | 97.51,74.16 97.31,73.96 | MS1.2 97.42,78.33 | J3.8 88.71,20.96 v88.37,21.3
  Top 0.61: v93.5,58.39 v96.04,58.39 v98.58,58.39 v101.12,58.39 v103.66,58.39 v106.2,58.39 v108.74,58.39 v111.28,58.39 v113.82,58.39 v116.36,58.39 v118.9,58.39 v121.44,58.39 v123.98,58.39 v126.52,58.39 v129.06,58.39 v131.6,58.39 v134.14,58.39 v136.68,58.39
  Top 1.524: 88.71,21.49 J3.8 | v93.5,58.39 93.5,61.86 97.23,65.59 MS1.2'
  Top 1.778: J6.P$2 J6.@2
  Top 2.54: v80.6,72.54 80.37,72.31 70.08,72.31
  VCC 0.508: J6.P$2 44.18,82.64 42.01,84.8 v11.99,84.8 | v97.64,71.7 v97.64,80.64 v96.8,80.64
  VCC 1.524: 80.28,72.54 79.39,71.65 79.39,65.87 70.33,56.81 70.33,52.97 71.95,51.36 77.04,51.36 79.84,54.16 83.94,54.16 85.97,52.13 85.97,24.39 88.57,21.79 | 88.57,21.79 88.62,21.79 | 88.57,21.79 88.67,21.68 88.67,20.64
  VCC 2.54: J6.P$2 44.18,73.09 45.85,71.42 58.22,71.42 59.36,72.56 v69.95,72.56 | 96.45,72.54 v80.6,72.54 80.28,72.54
  Bottom 0.305: v11.99,84.8 10.85,84.8 6.25,89.4 v6.25,97.2 | 88.8,20.39 v89.06,20.64
  Bottom 1.27: J6.P$2 J6.2
  other vias: 69.24,72.59 69.24,73.27 69.24,71.93 69.95,71.9 79.91,72.54 79.91,71.82 80.6,71.82 96.83,71.7 96.85,71.06 97.64,71.06 96.85,70.4 97.64,70.4 89.08,21.28 88.37,20.64 79.91,73.27 80.6,73.27 69.95,73.27
  pour Top (no thermals): 96.5,74.9 97.9,74.9 arc-90 98.3,74.5 98.3,70.3 arc-90 97.9,69.9 96.5,69.9 arc-90 96.2,70.2 96.2,74.6 arc-90
  pour VCC: 96.1,73.8 98.03,73.8 arc-90 98.53,73.3 98.53,70.43 arc-90 98,69.9 96.2,69.9 arc-90 95.9,70.2 95.9,73.6 arc-90
  pour VCC: 78.9,73.7 81.2,73.7 arc-90 81.6,73.3 81.6,71.5 arc-90 81.3,71.2 78.8,71.2 arc-90 78.5,71.5 78.5,73.3 arc-90
  pour Top: 69.3,73.55 71.2,73.55 71.2,71.6 arc-90 70.9,71.3 69.3,71.3 arc-90 68.75,71.85 68.75,73 arc-90
  pour VCC: 69,73.8 70.7,73.8 arc-90 71.3,73.2 71.3,71.8 arc-90 70.8,71.3 68.9,71.3 arc-90 68.5,71.7 68.5,73.3 arc-90
  pour Bottom: 88.2,22.1 89.1,22.1 arc-90 89.4,21.8 89.4,20.5 arc-90 89,20.1 88.2,20.1 arc-90 88,20.3 88,21.9 arc-90
  pour VCC: 88.2,21.8 89,21.8 arc-90 89.4,21.4 89.4,20.1 arc-90 89.2,19.9 88.3,19.9 arc-90 88,20.2 88,21.6 arc-90
  pour Top: 88.2,22.2 89.1,22.2 arc-90 89.4,21.9 89.4,20.1 arc-90 89.2,19.9 88.2,19.9 arc-90 88,20.1 88,22 arc-90
  pour Bottom: 69.04,73.5 70.08,73.5 arc-90 70.49,73.09 70.49,71.77 arc-90 70.21,71.49 69.32,71.49 arc-90 68.79,72.03 68.79,73.25 arc-90
  pour GND: 88.14,21.84 89.15,21.84 arc-90 89.41,21.59 89.41,20.45 arc-90 89.15,20.19 88.14,20.19 arc-90 88.01,20.32 88.01,21.72 arc-90
  pour GND: 79.76,73.53 80.52,73.53 arc-90 80.9,73.15 80.9,71.63 arc-90 80.64,71.37 79.76,71.37 arc-90 79.5,71.63 79.5,73.28 arc-90
  pour GND: 96.77,72.01 97.79,72.01 arc-90 98.04,71.75 98.04,70.23 arc-90 97.92,70.1 96.65,70.1 arc-90 96.52,70.23 96.52,71.75 arc-90
  pour GND: 69.22,73.66 69.85,73.66 arc-90 70.36,73.15 70.36,72.01 arc-90 69.98,71.63 68.96,71.63 arc-90 68.83,71.75 68.83,72.9 68.83,73.28 arc-90
  pour Top: 96.57,80.92 97.74,80.92 97.87,80.92 arc-90 97.97,80.82 97.97,79.25 97.97,78.92 arc-90 97.94,78.89 96.52,78.89 arc-90 96.49,78.92 96.49,80.75 96.49,80.85 arc-90
  pour VCC: 96.57,80.92 97.94,80.92 arc-90 98.53,80.34 98.53,71.15 arc-90 98.07,70.69 96.14,70.69 arc-90 95.91,70.92 95.91,73.74 96.19,73.74 arc90 97.16,74.7 97.16,78.03 arc90 96.8,78.38 96.42,78.38 arc-90 96.19,78.61 96.19,80.54 arc-90
!MODE  (via drill 0.3 pad 0.5)
  Top 0.152: J18.32 73.69,46.18 73.48,46.4 63.33,46.4 62.72,47 55.83,47 54.24,45.41 51.29,45.41 v50.17,44.28 | J3.18 76.01,16.77 v76,16.77 75.7,17.07 74.74,17.07 70.41,21.4 64.98,21.4 63.07,23.31 58.59,23.31 52.66,17.38 v52.45,17.38 | 128.3,12.17 MODE.4 125.34,12.17 v125.3,12.21 | 128.3,12.17 MODE.3 | R12.1 128.3,12.17
  Bottom 0.152: v50.17,44.28 48.11,42.23 48.11,19.6 50.32,17.38 v52.45,17.38 | v125.3,12.21 106.8,12.21 104.82,14.19 77.22,14.19 76,15.4 v76,16.77
!RESET  (via drill 0.3, 0.3 pad 0.5)
  Top 0.152: v73.47,16.7 J3.20 | JTAG.10 69.59,119.22 71.18,117.63 71.18,105.5 70.85,105.17 68.06,105.17 65.65,102.76 65.65,96.63 64.24,95.22 v64.24,92.98 | v104.93,12.21 v104.94,12.22 106.15,12.22 RESET.4 107.22,12.17 | J18.!RESET 70.83,34.31 71.43,33.71 v71.43,32.19 71.3,32.05 61.04,32.05 59.24,33.85 v56.57,33.85 | J6.P$23 | v56.56,46.41 56.77,46.63 62.45,46.63 63.04,46.04 73.02,46.04 73.38,45.68 J18.34 75.57,45.68 75.95,46.07 75.95,47.18 77.24,48.46 v78.99,48.46 | 107.22,12.17 RESET.3 | 107.22,12.17 C1.1 R4.1
  Top 0.254: J6.@23 J6.P$23
  Top 0.305: JP5.1 94.77,66.59 v94.67,66.49
  VCC 0.152: v73.47,16.7 73.47,30.21 71.5,32.19 v71.43,32.19 | J6.P$23 44.18,93.75 44.94,92.98 v64.24,92.98 70.24,92.98 73.05,90.17 73.05,68.22 56.51,51.68 56.51,46.46 v56.56,46.41 56.56,39.83 56.57,39.82 v56.57,33.85
  Bottom 0.152: v104.93,12.21 103.98,13.16 75.11,13.16 73.47,14.8 v73.47,16.7 | 44.6,99.66 J6.@23 J6.P$23 J6.23 | v94.67,66.49 94.61,66.55 89.82,66.55 85.67,62.4 85.67,49.84 83.93,48.1 81.97,48.1 81.34,48.73 79.26,48.73 v78.99,48.46
+3V3  (via drill 0.3 pad 0.5, 0.35)
  Top 0.152: J6.1 41.64,76.47 J6.P$1 | v64.05,110.71 64.08,110.68 | 74.5,51.44 70.41,51.44 70.33,51.36 v69.73,51.36 | R4.2 108.77,7.64 v109.86,7.64
  Top 0.203: LED3.1 72.23,103.65 73.59,103.65 73.94,103.3 R21.2
  Top 0.254: LED3.1 70.64,103.08 69.73,102.17 v69.73,101.21
  Top 0.305: J18.10 J18.12 73.81,51.18 73.56,51.44 74.5,51.44 J18.10 | 73.48,51.43 73.74,51.68 J18.10 | R2.2 63.89,110.49 64.08,110.68 64.41,110.34 D2.1 | U2.8 67.75,67.58 69.29,67.58 69.63,67.24 R24.2 70.67,68.12 71.22,68.67 74.72,68.67 | R25.2 74.72,68.67 | 74.72,68.67 78.56,68.67 78.78,68.47 R26.2 | R12.2 128.28,7.6 v128.28,6.79 | R16.1 v28.96,110.29
  Top 0.508: U2.8 66.45,67.52 v66.19,67.52 | 41.61,70.35 41.48,70.22 3V3.1 | v41.46,69.5 41.61,69.35 41.61,68.14 | RGB.CA 118.93,10.89 v119.92,10.89
  Top 0.762: 75.11,51.44 73.56,51.44 71.81,51.44
  Top 1.016: 3V3.1 41.61,67.62 41.61,68.14
  Top 1.524: 41.61,76.45 41.64,76.47
  Top 2.54: 41.61,70.35 41.61,76.45 41.61,76.89 J6.P$1 41.64,70.38 41.61,70.35 | 41.61,70.35 41.61,68.14 41.61,56.05 46.22,51.44 70.41,51.44 71.81,51.44
  VCC 0.152: 65.6,70.62 65.94,70.62
  VCC 0.254: v35.69,99.43 36.68,100.42 69,100.42 69.73,101.15 v69.73,101.21 69.78,101.21
  VCC 0.508: 66.09,67.62 v66.19,67.52 65.94,67.77 65.94,70.62 v69.12,70.62 69.09,70.64 v65,70.64 | 65.6,70.62 60.91,70.62 v60.89,70.6 59.8,69.51 v41.46,69.51 v41.46,69.5 | v69.73,51.36 71.39,49.7 81.23,49.7 82.53,50.99 83.7,50.99 84.64,50.05 84.64,22.04 88.07,18.6 88.07,11.85 91.92,7.99 109.5,7.99 v109.86,7.64 116.67,7.64 v119.92,10.89 122.92,10.89 127.02,6.79 v128.28,6.79
  Bottom 0.254: 35.84,104.29 35.97,104.16 35.97,103.96
  Bottom 0.305: v64.05,110.71 64.02,110.74 47.73,110.74 46.61,111.86 40.36,111.86 34.65,106.14 34.65,105.36 | 34.65,105.36 34.65,104.29 | 35.97,104.29 35.84,104.29 | v28.96,110.29 28.96,107.14 30.73,105.36 34.65,105.36
  Bottom 0.508: 41.64,74.22 41.56,74.14 | 35.97,104.29 35.97,103.96 35.78,104.15 | 35.61,104.31 35.78,104.15 | 35.78,104.15 35.56,103.93 35.56,99.56 v35.69,99.43 35.69,100.2
  Bottom 1.27: 41.64,74.22 J6.P$1 J6.1
  Bottom 2.54: 41.64,81.76 J6.P$1
  Bottom 3.81: 41.64,81.76
  Bottom 4.064: 41.64,81.76 35.08,88.32 35.08,103.41
  pour Bottom (no thermals): 41.15,78.3 42.32,78.3 arc-90 42.93,77.69 42.93,74.39 arc-90 42.17,73.63 40.92,73.63 arc-90 40.29,74.26 40.29,77.44 arc-90
  pour Bottom: 33.61,105.71 36.4,105.71 arc-90 37.11,105 37.11,102.97 arc90 36.98,103.09 33.17,103.09 33.17,105.28 arc-90
  pour Top (no thermals): 40.95,78.25 42.34,78.25 arc-90 42.9,77.69 42.9,74.26 arc-90 42.4,73.75 40.72,73.75 arc-90 40.31,74.16 40.31,77.62 arc-90
ADC0  (via drill 0.3 pad 0.5)
  Top 0.152: J18.23 82.3,48.07 81.89,47.67 80.29,47.67 v80,47.96 | J3.15 78.4,8.41 78.4,10.6 79.7,11.9 79.7,16.71 77.71,18.7 v76.98,18.7 v76.97,18.69
  Top 0.305: JP6.1 104.98,69.3 104.9,69.22 104.9,66.5 v105.03,66.37
  VCC 0.152: v76.97,18.69 76.99,18.71 76.99,30.95 80.52,34.48 80.52,47.43 v80,47.96
  Bottom 0.152: v105.03,66.37 104.57,65.91 89.84,65.91 86.29,62.36 86.29,49.23 84.76,47.69 80.27,47.69 v80,47.96
ADC1  (via drill 0.3 pad 0.5)
  Top 0.152: J18.33 v78.34,45.93 v78.33,45.92 | v72.73,11.29 72.8,11.37 75.13,11.37 76.01,10.49 J3.17 | J11.4 13.17,80.74 21.66,72.25 37.22,72.25 38.17,71.3 38.17,54.11 46.29,45.99 54.16,45.99 55.6,47.43 62.9,47.43 63.6,46.74 74.13,46.74 v74.5,47.11
  Top 0.305: JP7.1 v107.47,66.22
  VCC 0.152: v78.33,45.92 78.33,46.15 77.37,47.11 v74.5,47.11
  Bottom 0.152: v107.47,66.22 106.81,65.55 90.27,65.55 86.78,62.06 86.78,48.86 83.84,45.92 v78.33,45.92 78.31,45.9 68.03,45.9 58.82,36.69 58.82,19.94 60.33,18.43 70.14,18.43 71.68,16.89 71.68,12.3 72.69,11.29 v72.73,11.29
ADC2  (via drill 0.3 pad 0.5)
  Top 0.152: J18.35 82.28,45.41 v79.46,45.41 | v73.5,10.6 73.52,10.58 73.47,10.54 J3.19 | J11.3 11.91,82.74 21.88,72.77 37.57,72.77 38.58,71.76 38.58,54.26 46.41,46.42 53.93,46.42 55.38,47.87 63.09,47.87 63.82,47.13 73.62,47.13 74.34,47.86 v75.38,47.86
  Top 0.305: JP8.1 v110.01,66.12
  VCC 0.152: v75.38,47.86 77.84,47.86 79.46,46.24 v79.46,45.41
  Bottom 0.152: v110.01,66.12 109.07,65.17 90.65,65.17 87.23,61.75 87.23,48.49 84.15,45.41 v79.46,45.41 68.22,45.41 59.18,36.38 59.18,20.34 60.65,18.88 70.43,18.88 72.35,16.96 72.35,12.74 73.5,11.6 v73.5,10.6
ADC3  (via drill 0.3 pad 0.5)
  Top 0.152: J18.37 78.41,44.93 v78.33,44.86 | J3.21 70.91,8.28 70.91,11.11 72.15,12.35 v72.15,18.19
  Top 0.305: JP9.1 v112.55,66.02
  Bottom 0.152: v112.55,66.02 111.35,64.82 91.03,64.82 87.72,61.5 87.72,48.23 84.42,44.93 78.4,44.93 v78.33,44.86 78.33,44.89 78.27,44.95 68.29,44.95 59.56,36.22 59.56,20.75 60.93,19.39 70.95,19.39 v72.14,18.19 v72.15,18.19
ADC4  (via drill 0.3 pad 0.5)
  Top 0.152: J18.41 v78.34,43.93 v78.33,43.94 | v69.84,20.03 69.87,20 69.87,12.46 68.01,10.6 66.8,10.6 65.85,9.65 J3.25
  Top 0.305: JP10.1 v115.09,65.92
  Bottom 0.152: v78.33,43.94 78.34,43.96 | v115.09,65.92 113.6,64.43 91.35,64.43 88.2,61.28 88.2,48.08 84.08,43.96 78.34,43.96 | 78.34,43.96 77.83,43.96 77.19,44.6 68.53,44.6 60.05,36.12 60.05,21 61.05,20 69.8,20 v69.84,20.03
ADC5  (via drill 0.3 pad 0.5)
  Top 0.152: J18.43 82.29,43.44 v79.46,43.44 | J3.27 63.31,10.46 64.06,11.2 67.97,11.2 69.47,12.7 69.47,19.35 68.24,20.58 v68.21,20.58
  Top 0.305: JP11.1 v117.63,65.82
  Bottom 0.152: v117.63,65.82 115.87,64.06 91.82,64.06 88.66,60.9 88.66,47.63 84.47,43.44 v79.46,43.44 77.4,43.44 76.6,44.24 68.84,44.24 60.6,36.01 60.6,21.21 61.27,20.54 68.17,20.54 v68.21,20.58
ADC6  (via drill 0.3 pad 0.5)
  Top 0.152: v78.33,42.93 v78.34,42.93 J18.45 | 61.33,21.39 v61.33,21.42 61.84,20.91 61.84,2.71 61.55,2.42 60.82,2.42 JP4.2 60.74,2.19
  Top 0.254: J6.@16 J6.P$16
  VCC 0.152: J6.P$16 61.96,95.4 63.59,93.77 72.94,93.77 73.92,92.79 73.92,68 62.68,56.76 62.68,37.17 v62.35,36.84
  Bottom 0.152: v61.33,21.42 61.35,21.44 61.35,35.84 v62.35,36.84 68.44,42.93 v78.33,42.93 | J6.16 J6.P$16
ADC7  (via drill 0.3 pad 0.5)
  Top 0.152: J18.47 v79.47,42.43 v79.46,42.44 | J3.31 58.23,11.03 59.46,12.26 59.46,20.92 60.65,22.11 v62.04,22.11
  Bottom 0.152: v79.46,42.44 79.22,42.44 78.55,41.77 68.1,41.77 62.05,35.72 62.05,22.12 v62.04,22.11
CHG
  Top 0.203: R13.2 72.93,101.42 72.01,100.5 70.74,100.5 69.58,99.34
  Top 0.254: J6.@13 J6.P$13 69.58,99.34
  Bottom 0.152: J6.13 J6.P$13
CS  (via drill 0.3, 0.3 pad 0.5)
  Top 0.152: v58.05,43.55 58.81,43.55 60.6,41.75 72.69,41.75 73.12,42.18 J18.48 75.81,42.18 77.34,43.71 77.34,46.07 77.88,46.61 78.76,46.61 78.99,46.37 86.4,46.37 90.98,50.95 90.98,100.05 v90.9,100.12 | J3.34 55.69,16.81 v55.74,16.85
  Top 0.305: JP23.2 v120.17,109.34
  VCC 0.152: v49.81,21.03 51.49,21.03 55.67,16.85 v55.74,16.85 | v90.9,100.12 96.17,100.12 105.38,109.34 v120.17,109.34
  Bottom 0.152: v49.81,21.03 49.8,21.03 49.8,41.18 52.33,43.71 57.89,43.71 v58.05,43.55
CTS  (via drill 0.3, 0.3 pad 0.5)
  Top 0.152: v51.57,44.72 51.61,44.76 56.95,44.76 58.42,46.23 62.09,46.23 63.78,44.54 72.27,44.54 72.62,44.18 J18.40 75.66,44.18 77.02,45.55 77.02,46.34 77.7,47.02 78.88,47.02 79.22,46.68 85.74,46.68 90.5,51.44 90.5,95.12 v90.09,95.53 | J3.26 65.85,16.7 v65.81,16.75
  Top 0.305: JP25.2 v125.25,106.39
  VCC 0.152: v90.09,95.53 97.33,95.53 107.44,105.63 118.31,105.63 119.07,106.39 v125.25,106.39
  Bottom 0.152: v51.57,44.72 48.65,41.8 48.65,19.95 50.61,17.99 57.62,17.99 59.52,16.09 64.55,16.09 65.21,16.75 v65.81,16.75
EN
  Top 0.508: MS1.27' 107.58,101.19 107.58,96.75 MS1.27
GND  (via drill 0.3, 0.3 pad 0.5, 0.35, 1.02 pad 1.91)
  Top 0.152: 77.74,109.72 D23.2 | 80.22,109.68 R3.2 80.17,109.63 79.27,109.63 R1.2 | v66.12,66.25 | 83.57,41.93 v83.61,41.89 | JTAG.9 v68.11,113.75 v68.1,113.74 | JTAG.5 v65.57,113.67 v65.56,113.66 | JTAG.3 v64.3,113.68 | 57.25,112.82 v57.25,112.67 | R9.2 56.24,109.86 | 57.29,109.86 56.81,109.86 | 105.95,10.47 RESET.2 | 125.26,10.62 v125.25,10.64 | MS1.4 MS1.4' 102.31,73.88 102.31,71.88 v102.34,71.85 | R10.2 58.51,109.77 | U1.2 69.17,109.74 v68.82,109.39 | v83.35,33.67 83.35,34.08 83.09,34.33 J18.76 83.16,34.33 v83.35,34.52 | v82.74,56.23 82.74,55.36 82.46,55.08 82.42,55.03 J18.77 81.14,55.03 80.76,55.03 80.63,55.03 80.38,55.03 | v81.2,56.28 v81.2,56.27 | J3.9 86.17,6.06 v86.22,6.01 | J3.7 88.71,8.2 88.66,8.26 | 77.6,42.33 77.98,41.95 82.29,41.95 J18.49 | v5.11,99.41 5.09,99.39 5.09,99.31 | 79.78,50.82 79.78,50.9 v79.72,50.95 | J6.P$9 62,76.91 | 62,76.91 J6.P$10 | J6.9 61.96,75.15 61.96,76.86 62,76.91 | 81.59,55.16 80.9,55.16 80.79,55.27 80.5,55.56 v80.5,56.31 | 56.92,62.69 v56.95,62.72 | 49.26,97.33 49.26,97.25 J6.P$21 | J18.9 81.36,51.93 80.68,52.62 80.46,52.62 v80.32,52.62 | 58.43,109.86 R10.2 | C1.2 v107.22,6.78
  Top 0.254: J18.21 83.48,48.93 v83.58,48.83 | J18.15 84.22,50.43 84.68,50.9 v84.68,51.21 | 83.63,53.93 84.07,53.49 84.07,53.34 84.07,52.93 | 83.98,53.43 84.18,53.23 84.18,52.43 84.18,51.71 84.21,51.68 | J18.39 79.47,44.43 v79.46,44.45
  Top 0.305: 56.88,63.82 v56.95,63.76 | U2.7 v66.12,66.25 | 80.6,113.99 USB2.GND 80.6,113.99 80.91,113.67 81.49,113.67 v81.97,113.19 | USB2.GND2 74.15,113.74 73.66,113.25 v72.75,113.25 | USB1.GND2 49.76,113.9 49.44,113.58 v47.68,113.58 | USB1.GND 57.25,113.14 57.25,112.82 | J18.56 74.75,40.19 76.07,40.19 76.85,40.97 v76.85,42.3 | J18.49 83.57,41.93 | S1.2 19.67,117.39 19.64,117.42 21.58,117.42 S1.2 | D1.2 54.85,109.86 56.24,109.86 | R6.2 56.81,109.86 | 56.81,109.86 R9.2 | R9.2 58.43,109.86 58.51,109.77 | R10.2 | R10.2 C3.2 59.61,109.42 59.74,109.28 v59.92,109.28 | v56.74,109.28 56.74,109.79 56.81,109.86 | v57.76,109.28 57.48,109.28 57.4,109.36 R9.2 | v58.88,109.28 58.6,109.28 58.51,109.37 R10.2 | 77.67,109.69 D23.2 79.03,109.74 R1.2 | 79.26,109.64 79.27,109.63 | S1.5 S1.2 | RT2.1 23.62,104.27 TP8.1 | R5.2 C2.2 v82.32,108.98 v82.32,108.97 | R5.2 80.17,109.63 | R3.2 R1.2 v79.15,109.02 v79.14,109.01 | R3.2 | R3.2 v80.27,109 | R5.2 81.29,108.99 v81.28,108.97 | R29.2 80.8,68.38 v81.22,68.8 | 76.81,67.3 R28.2 76.98,67.24 v77.68,67.94 | R27.2 73.52,67.24 73.76,67 v73.76,66.47 | R17.1 v19.41,107.77 | 80.77,53.72 80.98,53.93 81.03,53.93 | 80.77,53.72 80.64,53.59 80.38,53.86 80.38,55.03 | 80.77,53.72 81.06,53.43 J18.3 83.98,53.43 84.07,53.34 | 80.77,52.93 J18.5 84.07,52.93 | 80.77,52.93 80.46,52.62 | 80.77,52.93 81.27,52.43 J18.7 84.18,52.43 84.2,52.45 | J18.1 81.59,53.93 | J18.1 81.03,53.93 | 81.03,53.93 80.94,54.02 | 80.94,54.86 81.2,55.12 | 82.3,54.91 82.46,55.08 | J18.1 83.61,53.93 | 83.61,53.93 83.63,53.93 | 83.61,53.93 83.69,53.85 | J18.9 83.96,51.93 84.21,51.68 v84.68,51.21 | 80.76,53.86 80.76,55.03 | 81.14,53.86 81.14,55.03 | J18.15 80.17,50.43 79.78,50.82
  Top 0.305: J18.39 83.61,44.43 83.62,44.42
  Top 0.381: C10.2 56.88,63.82 | C9.2 56.92,62.69 | C9.2 56.26,62.67 56.26,61.72 56.53,61.45 v56.95,61.45 | C9.2 C10.2 | C10.2 C8.2 | C8.2 56.25,66.45 56.58,66.78 56.58,66.92 C20.2 | C8.2 v56.95,65.18 | v60.65,63.73 60.67,63.71 U2.4 62.49,62.24 62.48,62.23 | R22.1 v26.18,107.86 v26.19,107.85
  Top 0.508: v102.24,80.69 102.24,78.34 MS1.4 102.31,73.88 | MS1.4' 102.34,73.92 v102.34,71.85 | J6.P$22 46.73,97.25 49.26,97.25 | J6.P$21 49.26,97.33 | C20.2 58.3,67.42 v58.35,67.37 | v44.94,68.05 46,68.05 46.59,67.46 C61.2 | J4.1 5.09,99.31 | J4.1 v6.66,98.28 6.69,98.24 | J4.1 3.2,98.28 3.2,98.27 | J11.1 12.04,86.74 v12.07,86.71 | J11.1 9.72,88.24 9.71,88.26 | J11.1 6.62,86.74 6.59,86.71 | RESET.1 109.81,10.58 v109.81,9.87 | v105.95,9.87 105.95,10.47 | MODE.2 125.26,10.62 | MODE.1 130.19,10.64 v131.35,10.64 | 88.71,6.01 v88.67,6.01 | 91.25,6.01 v91.21,6.01 | 93.79,6.01 v93.75,6.01 | 96.33,6.01 v96.28,6.01 | v22.66,5.05 22.67,5.05 J3.59 21.66,8.26 | v21.39,9.37 21.39,8.53 21.66,8.26 | v21.39,5.56 21.39,7.99 21.66,8.26 | J3.42 45.52,14.49 v45.52,16.84 | J3.33 55.68,8.27 v55.68,10.74 | J18.77 81.29,55.27 80.79,55.27
  Top 0.61: v93.5,30.45 v96.04,30.45 v98.58,30.45 v101.12,30.45 v103.66,30.45 v106.2,30.45 v108.74,30.45 v111.28,30.45 v113.82,30.45 v116.36,30.45 v118.9,30.45 v121.44,30.45 v123.98,30.45 v126.52,30.45 v129.06,30.45 v131.6,30.45 v134.14,30.45 v136.68,30.45
  Top 0.635: J3.7 88.71,6.01 | J3.5 91.25,6.01 | J3.3 93.79,6.01 | 96.33,6.01 J3.1 96.46,8.13 98.3,8.13
  Top 0.762: 81.66,56.9 81.65,56.88 81.65,55.16 J18.77 84.54,55.03 84.58,54.99 | 82.54,55.03 82.54,56.76 | 80.63,55.03 80.63,56.76 | C20.2 57.07,69.65 57.4,69.98 | C20.2 59.11,67.42 v59.16,67.37 | C20.2 57.07,65.24 57.05,65.21 | D17.A 11.11,97.6 11.05,97.66 | D17.A 10.97,95.83 v9.13,95.83 | D17.A 11.17,95.76 12.7,95.76 | D17.A 11.11,93.82 v11.53,93.82
  Top 1.016: J2.3 13.7,114.54 16.52,114.54 | J2.3 10.31,114.46 | J2.3 13.62,116.96 | J2.3 13.62,112.59 | J2.2 8.82,114.63 | J2.2 5.72,111.46 | J2.2 8.82,108.87 | J2.2 12.53,111.46 13.6,112.54 | J6.P$21 49.26,95.52 | J6.P$22 46.72,98.94 | J6.P$9 J6.P$10 64.5,76.07 64.5,75.18 64.38,75.06 | J6.P$9 61.96,78.96 | 61.96,78.96 61.96,79.28 62.01,79.33 | 61.98,78.94 61.96,78.96 | J6.P$9 61.96,75.15 | 63.94,74.95 62.03,74.95 J6.9 | J6.9 61.91,74.92 | J6.P$9 61.94,76.91 61.94,76.92 | J6.9 61.96,73.48 | 13.64,86.74 J11.1 9.69,86.71 v6.58,86.71 | C61.2 46.59,65.98 46.41,65.81 | 46.66,70.96 46.66,67.49 C61.2 | C61.2 44,67.42 v43.97,67.39 | C61.2 46.6,67.43 47.58,67.43 | J18.78 36.5,44.73 v36.5,50.54
  Top 1.524: J18.78 41.47,44.66 41.48,44.67 J18.78 | J18.78 29.38,44.66 | J18.78 36.56,50.42 | J18.78 36.56,39.53 | J5.P$1 10.29,56.66 | J5.P$1 1.25,56.66 | J5.P$1 5.21,61.54 | J5.P$1 5.21,51.78 | J7.P$1 5.21,37.56 | J7.P$1 10.09,32.68 | J7.P$1 1.29,32.68 | J7.P$1 5.21,28.42 | X1.4 2.89,26.57 | X1.4 2.88,23.34 1.19,23.34 | X1.4 10.68,23.36 10.7,23.34 | 7.99,25.63 X1.5 7.99,15.86 | 11.1,18.25 X1.2 1.19,18.25 1.19,18.26 | X1.4 X1.3 2.89,15.59 | X3.4 2.79,49.93 2.77,49.95 2.77,47.07 X3.4 | X3.4 2.79,39 | 7.89,50.2 X3.5 7.89,39.02 | 11.18,41.95 X3.3 2.77,41.93 1.19,41.93 | X3.4 10.25,47.05 | X3.4 1.29,47.05 1.25,47.01 | X2.4 11.04,70.74 | X2.4 1.24,70.74 | X2.4 2.82,73.89 | X2.4 2.82,62.91 | 7.92,74.3 X2.5 7.92,62.89 | 11.16,65.64 X2.3 2.76,65.7 1.25,65.7 | S1.5 19.57,117.39 | 46.15,119.86 46.12,119.89 S4.3 41.58,119.86 40.16,119.86 | J6.@22 46.72,95.22 | J6.@21 49.26,95.14 | 64.5,76.07 64.5,73.17 64.9,72.77 | J6.@10 J6.P$10 64.39,77.02 64.39,79.88 | J6.P$9 62.1,76.91 62.1,71.88 | J6.9 v61.96,79.49 v61.95,79.5
  Top 1.778: v45.55,95.22 49.18,95.22 49.26,95.14
  VCC 1.016: J18.78 36.56,47.54 36.4,47.7 | J18.78 40.45,44.66 40.72,44.4 | J18.78 36.56,41.41 36.35,41.2 36.35,41.07 36.47,40.95 | J18.78 32.52,44.66 32.41,44.78
  Bottom 0.152: X3.5 X3.4 | D12.1 15.03,27.57 v15.01,27.58 | U7.1 v13.47,26.38 v13.46,26.38 | v13.9,18.84 13.9,18.17 C7.2 13.9,18.14 D7.1 13.9,16.43 J13.C5 v12.38,13.84 v12.37,13.84 | v18.55,18.13 17.95,18.13 C6.2 17.93,17.17 D11.1 v18.54,17.16 v18.55,17.16 | v15.9,18.89 v15.91,18.88 C4.2 15.89,18.13 D13.1 v15.89,16.44 v15.88,16.43 | v17.83,27.6 C5.2 | J6.P$21 49.15,97.23 46.89,97.23 | 46.89,97.23 J6.P$22 | J6.22 46.72,95.22 46.72,97.06 46.89,97.23 | v79.72,50.95 v79.72,50.94 79.94,50.72 81.19,50.72 82.74,52.27 82.74,56.38 | v83.58,48.83 83.56,48.83 83.35,49.04 76.54,49.04 v76.25,48.75 64.56,48.75 arc90 63.48,47.66 63.48,43.99 59.42,39.94 57.36,39.94 55.73,41.57 53.24,41.57 52.35,40.68 52.02,40.35 52.02,24.67 52.62,24.08 v52.62,21.76 v52.61,21.75
  Bottom 0.508: 46.72,95.22 J6.P$22 49.15,97.23 | J6.P$21 J6.21 | J6.P$9 J6.9 | J6.P$10 J6.10 | S4.3 S4.6
  Bottom 1.016: v36.5,39.47 v36.5,50.54 | v41.56,44.65 29.59,44.65 v29.49,44.75
  Bottom 1.524: 46.86,92.08 46.72,92.22 J6.P$22 46.72,100.22 46.61,100.33 | 49.02,94.49 49.26,94.72 J6.P$21 49.26,102.22 49.28,102.23
  other vias: 68.4,69.43 44.94,63.86 64.9,69.22 71.15,70.36 65.58,112.79 88.67,3.86 91.21,3.86 93.75,3.86 33.39,111.88 71.54,43.65 71.52,42.3 58.75,44.86 61.24,44.89 10.29,119.6 12.83,119.6 15.37,119.6 19.31,117.4 10.29,117.06 13.64,117.04 15.37,117.06 2.57,102.97 2.57,104.49 2.57,107.03 2.57,109.57 2.57,112.11 5.91,111.41 8.81,108.67 5.11,107.03 5.11,104.49 5.11,102.97 7.65,101.95 7.65,104.49 7.65,107.03 3.23,98.29 2.57,91.79 2.57,86.71 2.57,84.17 2.57,81.63 2.77,76.55 2.77,74.11 7.85,76.55 12.73,76.55 17.81,46.52 22.89,46.52 27.97,46.52 27.97,68.93 12.73,68.93 27.97,63.85 27.97,58.77 27.97,48.61 27.97,38.45 22.89,63.85 17.81,63.85 12.73,63.85 12.73,58.77 10.33,36.74 22.89,53.69 22.89,48.61 17.81,48.61 12.73,48.61 12.73,43.53 17.81,43.53 22.89,38.45 17.81,38.45 12.73,38.45 10.19,32.66 12.73,28.29 17.81,34.74 22.89,34.74 2.87,13.05 7.95,13.05 33.15,68.93 33.15,63.85 33.15,58.77 33.15,53.69 33.05,38.45 43.56,38.42 28.7,113.96 28.7,116.5 64.31,112.79 64.3,117.49 65.57,117.49 66.84,117.49 68.11,117.49 69.38,117.49 69.38,116.22 69.38,114.95 69.38,113.68 18.21,81.73 18.21,87.12 17.81,89.25 15.27,89.25 15.27,86.71 15.22,83.89 15.27,81.63 27.97,34.74 33.05,34.74 36.48,34.74 43.56,34.74 95.32,91.92 99.13,91.92 102.94,91.92 106.75,91.92 110.56,91.92 114.37,91.92 118.18,91.92 121.99,91.92 125.8,91.92 129.61,91.92 133.42,91.92 95.32,89.38 99.13,89.38 102.94,89.38 106.75,89.38 110.56,89.38 114.37,89.38 118.18,89.38 121.99,89.38 125.8,89.38 129.61,89.38 133.42,89.38 95.32,86.84 95.32,84.3 99.13,86.84 102.94,86.84 106.75,86.84 110.56,86.84 114.37,86.84 118.18,86.84 121.99,86.84 125.8,86.84 129.61,86.84 133.42,86.84 99.13,84.3 102.94,84.3 106.75,84.3 110.56,84.3 114.37,84.3 118.18,84.3 121.99,84.3 125.8,84.3 129.61,84.3 133.42,84.3 95.32,81.76 99.13,81.76 102.94,81.76 106.75,81.76 110.56,81.76 114.37,81.76 118.18,81.76 121.99,81.76 125.8,81.76 129.61,81.76 99.13,95.73 137.23,91.92 137.23,95.73 137.23,99.54 137.23,103.35 137.23,107.16 137.23,110.97 133.42,110.97 133.42,107.16 129.61,110.97 107.99,120.64 110.53,120.64 113.07,120.64 115.61,120.64 118.15,120.64 120.69,120.64 123.23,120.64 125.77,120.64 129.58,120.64 129.61,117.32 129.61,114.78 137.23,89.38 137.23,86.84 137.23,84.3 133.42,81.76 137.23,81.76 137.23,79.22 137.23,76.68 137.23,74.14 137.23,71.6 137.23,69.06 137.23,66.52 137.23,63.98 134.69,71.6 134.69,69.06 134.69,66.52 134.69,63.98 132.15,63.98 132.15,66.52 132.15,69.06 101.67,97.02 101.67,95.73 88.97,91.92 88.97,89.38 88.97,86.84 88.97,84.3 88.97,81.76 87.42,91.92 87.42,89.38 87.42,86.84 87.42,84.3 87.42,81.76 88.97,79.22 87.42,79.22 87.42,76.68 88.97,76.68 44.94,65.97 44.94,64.8 45.47,62.29 46.04,63.86 46.04,64.8 46.04,65.96 46.85,65.96 44.94,67.34 44.94,66.63 58.35,68.18 58.35,66.66 59.16,68.18 59.16,66.66 58.22,65.18 59.49,65.18 58.22,63.76 59.49,63.76 58.22,62.72 59.49,62.72 58.22,61.45 59.49,61.45 78.85,97.62 80.53,97.63 81.2,97.63 82.78,97.63 78.85,96.86 80.53,96.87 78.85,96.1 80.53,96.11 81.2,96.87 82.78,96.87 81.2,96.11 82.78,96.11 78.6,102.47 80.92,102.47 78.62,101.3 80.92,101.21 82.91,102.47 82.91,101.2 56.75,107.68 57.76,107.68 58.88,107.68 78.85,92.92 78.85,91.02 78.85,89.11 78.85,86.57 78.85,84.03 78.85,81.49 78.85,78.95 78.85,76.41 80.53,92.93 81.2,92.93 82.78,92.93 80.53,91.03 80.53,89.12 80.53,86.58 80.53,84.04 80.53,81.5 80.53,78.96 80.53,76.42 81.2,91.03 82.78,91.03 81.2,89.12 82.78,89.12 81.2,86.58 82.78,86.58 81.2,84.04 82.78,84.04 81.2,81.5 82.78,81.5 81.2,78.96 82.78,78.96 81.2,76.42 82.78,76.42 82.81,68.8 76.61,120.02 74.7,120.02 74.7,117.48 76.61,117.48 78.51,120.02 78.51,117.48 21.85,2.62 25.66,2.62 28.2,2.62 30.74,2.62 33.28,2.62 35.82,2.62 38.36,2.62 40.9,2.62 43.44,2.62 45.98,2.62 48.52,2.62 51.06,2.62 53.6,2.62 56.14,2.62 58.68,2.62 63.76,2.62 66.3,2.62 68.84,2.62 71.38,2.62 73.92,2.62 76.46,2.62 79,2.62 81.54,2.62 84.08,2.62 86.12,2.62 88.67,2.62 91.21,2.62 93.75,2.62 96.29,2.62 98.83,2.62 101.37,2.62 103.91,2.62 106.45,2.62 108.99,2.62 111.53,2.62 115.34,2.62 117.88,2.62 120.42,2.62 122.96,2.62 125.5,2.62 128.04,2.62 130.58,2.62 40.29,105.86 41.56,105.86 42.83,105.86 39.02,105.86 44.1,105.86 66.97,112.41 68.12,112.79 66.07,23.21 68.61,23.21 71.15,23.21 74.96,23.21 66.07,24.23 68.61,24.23 71.15,24.23 74.96,24.23 74.96,21.94 74.96,20.67 74.96,19.4 74.96,18.13 72.42,23.21 72.42,24.23 72.42,21.94 72.42,20.67 80.04,20.67 80.04,19.4 17.81,80.36 20.35,80.36 22.89,80.36 24.67,73.75 26.44,73.75 28.22,73.75 30,73.75 31.78,73.75 33.56,73.75 35.33,73.75 37.11,73.75 38.89,72.99 39.4,71.47 39.4,68.93 39.4,66.39 39.4,63.85 39.4,61.31 39.4,58.77 39.4,56.23 40.87,53.41 41.94,52.42 43.67,64.8 43.67,62.29 43.67,59.72 43.67,57.18 45.47,59.72 45.47,57.18 46.21,54.64 49.26,95.45 47.96,95.14 47.96,94.38 45.54,95.9 45.54,94.43 46.41,93.74 47.09,93.72 57.33,113.43 12.02,9.62 11.99,7.94 11.64,4.77 12.37,12.57 12.37,11.3 14.91,11.3 14.91,12.57 14.91,13.84 17.45,11.3 17.45,12.57 19.99,11.3 19.99,12.57 17.45,10.03 55.41,117.49 54.14,117.49 52.87,117.49 51.6,117.49 50.33,117.49 68.83,110.18 68.22,109.72 68.61,26.38 71.15,26.38 72.42,26.38 74.96,26.38 79.6,26.18 80.67,25.11 81.94,22.57 83.21,21.3 84.48,20.03 85.75,18.76 81.31,30.19 81.31,28.92 83.21,30.19 83.21,28.92 83.21,27.65 83.21,26.38 48.87,47.28 50.65,49.31 52.17,49.31 53.44,49.31 46.21,48.62 45.19,49.56 43.08,51.28 44.1,50.39 39.14,52.04 40.29,50.9 41.43,49.75 42.45,48.74 43.59,47.59 47.09,45.12 43.59,45.94 43.59,43.15 43.59,41.62 43.59,40.1 20.35,81.63 59.9,107.63 58.58,117.49 58.58,120.03 21.21,104.26 21.21,103.4 21.21,105.23 13.59,112.72 16.51,114.57 10.31,114.52 8.84,114.73 3.99,99.38 6.23,99.41 9.71,88.28 46.69,119.91 39.68,119.76 7.85,74.52 11.2,70.76 11.31,65.47 7.95,62.83 2.77,62.83 5.21,61.82 7.89,39.08 2.71,38.97 11.25,41.92 5.21,28.29 2.87,26.77 7.95,25.95 10.8,23.31 11,18.33 7.95,15.79 2.87,15.49 7.88,50.36 10.31,47.11 2.69,50.16 10.39,56.74 13.64,86.71 22.89,111.22 9.13,96.67 9.13,95.04 10.57,93.82 33.39,117.31 64.49,80.79 81.97,112.4 82.73,113.19 82.73,112.4 43.94,68.1 30.64,108.67 31.25,108.64 29.93,107.91 31.93,107.91 34,117.31 34,117.87 33.39,117.87 33.39,118.42 34,118.42 34,111.88 34,111.27 33.39,111.27 11.59,111.42 96.25,3.86 86.22,3.86 98.2,9.32 99.09,9.32 98.2,7.03 99.09,7.03 99.98,7.03 98.2,6.14 99.09,6.14 99.98,6.14 77.61,42.3 17.81,53.69 17.81,58.77 22.89,58.77 22.89,68.93 17.81,68.93 22.89,76.55 22.89,43.53 27.97,43.53 71.78,30.45 71.78,29.56 70.64,29.18 80.04,32.86 81.18,32.23 100.36,18.46 102.9,18.46 105.44,18.46 107.98,18.46 110.52,18.46 113.06,18.46 115.6,18.46 118.14,18.46 120.68,18.46 123.22,18.46 125.76,18.46 128.3,18.46 130.84,18.46 133.38,18.46 135.92,18.46 107.98,15.92 110.52,15.92 113.06,15.92 115.6,15.92 118.14,15.92 120.68,15.92 123.22,15.92 125.76,15.92 128.3,15.92 130.84,15.92 133.38,15.92 135.92,15.92 113.06,10.84 113.06,9.57 104.17,10.84 101.63,10.84 104.17,9.57 101.63,9.57 126.52,9.37 130.33,9.37 83.68,44.45 100.36,21 100.36,23.54 102.9,21 102.9,23.54 105.44,21 105.44,23.54 107.98,21 107.98,23.54 110.52,21 110.52,23.54 113.06,21 113.06,23.54 115.6,21 115.6,23.54 118.14,21 118.14,23.54 120.68,21 120.68,23.54 123.22,21 123.22,23.54 125.76,21 125.76,23.54 128.3,21 128.3,23.54 130.84,21 130.84,23.54 133.38,21 133.38,23.54 135.92,21 135.92,23.54 111.79,9.57 111.79,10.84 114.33,10.84 114.33,9.57 101.37,6.43 103.91,6.43 108.99,6.43 111.53,6.43 117.88,6.43 120.42,6.43 122.96,6.43 125.5,6.43 130.58,6.43 100.36,10.84 99.09,10.84 99.09,12.11 100.36,12.11 101.63,12.11 102.9,12.11 102.9,10.84 102.9,9.57 100.36,9.32 21.62,111.22 24.16,111.22 20.35,111.22 12.73,89.25 67.13,69.43 69.67,69.43 25.43,111.22 26.7,111.22 27.97,111.22 21.21,106.5 22.48,106.5 23.75,106.5 25.02,106.5 26.29,106.5 30.94,106.6 91.48,120.64 88.94,120.64 86.4,120.64 86.4,118.1 88.94,118.1 91.48,118.1 86.4,115.56 88.94,115.56 91.48,115.56 86.4,113.02 88.94,113.02 91.48,113.02 86.4,110.48 88.94,110.48 91.48,110.48 94.02,110.48 96.56,110.48 99.1,110.48 101.64,110.48 125.8,117.32 12.73,46.52 12.73,53.69 12.73,34.74 22.89,73.75 20.86,75.53 19.33,77.06 17.81,78.58 16.28,79.85 20.35,78.58 22.89,78.58 31.78,80.61 27.21,80.61 31.78,77.06 34.83,77.06 34.83,80.61 21.62,77.06 18.21,83.76 33.3,78.83 33.3,75.53
  pour Top (isolate 0.279, rank 3): 0,122 0,0 142,0 142,122
  pour Bottom (isolate 0.279, rank 3): 0,122 0,0 146,0 146,122
  cutout Bottom: 13.31,8.38 13.31,5.07 15.34,5.07 15.34,8.38
  cutout VCC: 13.31,8.38 13.31,5.07 15.24,5.07 15.24,8.38
  cutout Top: 13.31,8.38 13.31,5.07 15.34,5.07 15.34,8.38
  pour GND (rank 3, no thermals): 0,122 144,122 144,0 0,0
  cutout VCC (no thermals): 12.68,109.47 14.51,109.47 arc-90 15.57,108.4 15.57,108.17 arc-90 14.56,107.16 12.63,107.16 arc-90 11.61,108.17 11.61,108.4 arc-90
  cutout GND (no thermals): 12.58,109.34 14.63,109.34 arc-90 15.57,108.4 15.57,108.12 arc-90 14.86,107.41 12.52,107.41 arc-90 11.59,108.35 arc-90
  pour Top (no thermals): 32.9,118.81 34.42,118.81 34.42,110.86 32.9,110.86
  pour Top (no thermals): 29.67,107.31 29.67,108.4 30.23,108.96 31.6,108.96 32.21,108.35 32.21,107.31
  cutout Top: 21.97,12.57 21.97,10.16 97.28,10.16 97.28,10.67 97.28,12.45 96.9,12.45 96.9,12.57
  cutout Top: 81.53,53.72 83.06,53.72 83.06,52.07 81.53,52.07
  cutout Top: 88.27,10.03 88.27,6.48 88.39,6.6 97.03,6.6 97.03,10.03
  pour VCC (isolate 0.406, rank 4): 0,122.05 143,122.05 143,0 0,0
  cutout VCC: 93.09,62.18 136.88,62.18 arc-90 138.07,60.99 138.07,27.3 arc-90 137.52,26.75 92.86,26.75 arc-90 91.69,27.91 91.69,60.83 arc-90 93.04,62.18
  cutout Bottom: 93.24,62.2 136.8,62.2 arc-90 138.02,60.99 138.02,27.28 arc-90 137.52,26.77 92.96,26.77 arc-90 91.64,28.09 91.64,60.6 arc-90
  cutout VCC: 74.27,67.46 78.18,67.46 arc-90 78.33,67.31 78.33,65.84 arc-90 78.31,65.81 73.15,65.81 arc-90 73.1,65.86 73.1,67.44 arc-90 73.13,67.46
  cutout VCC: 79.17,34.21 79.17,31.57 81.53,31.57 arc90 81.56,31.6 81.56,34.26 81.56,34.32 79.17,34.32 79.17,34.24
  cutout Top: 92.23,58.85 92.23,32.77 arc90 93.27,31.72 137.08,31.72 arc90 137.92,32.56 137.92,59.41 arc90 137.67,59.66 93.04,59.66
  cutout GND: 93.62,62.59 136.75,62.59 arc-90 137.9,61.44 137.9,27.33 arc-90 137.57,27 93.45,27 arc-90 92,28.45 92,60.99 arc-90 93.6,62.59
  pour Top (no thermals): 24.38,79.88 30.1,79.88 30.1,74.04 24.26,74.04 24.26,79.88
  pour Top (no thermals): 24.26,56.26 30.23,56.26 30.23,50.29 24.26,50.29
  pour Top (no thermals): 24.38,32.64 30.23,32.64 30.23,26.8 24.13,26.8 24.13,32.64
GPIO0  (via drill 0.3 pad 0.5)
  Top 0.152: J18.62 72.03,38.68 71.67,39.04 57.76,39.04 56.66,40.14 v55.32,40.14 | J3.48 37.91,22.03 42.87,26.98 v53.27,26.98 | v53.27,26.98
  Top 0.305: JP26.2 v127.79,108.43
  VCC 0.152: v74.44,99.94 74.48,99.98 89.3,99.98 91.31,101.99 96.21,101.99 105.29,111.07 122.15,111.07 124.79,108.43 v127.79,108.43 | v55.32,40.14 55.32,51.65 72.19,68.52 72.19,88.96 v72.04,89.11 | v72.04,89.11
  Bottom 0.152: v55.32,40.14 54.91,40.14 53.27,38.49 v53.27,26.98 | v74.44,99.94 71.37,96.87 71.37,89.78 v72.04,89.11
GPIO1  (via drill 0.3 pad 0.5)
  Top 0.152: J18.64 71.78,38.18 71.32,38.64 57.34,38.64 56.75,39.24 55.44,39.24 55.07,38.87 v54.7,38.87 | J3.50 35.33,14.52 35.33,21.58 41.76,28 v53.86,28 | J6.7 J6.P$7
  VCC 0.152: v54.7,38.87 54.72,38.87 54.72,51.68 71.74,68.71 71.74,74.01 71.3,74.46 71.3,74.48 57.85,74.48 56.88,75.45 J6.P$7
  Bottom 0.152: v53.86,28 53.86,37.87 54.7,38.71 v54.7,38.87 | J6.P$7 J6.7
LED_BLUE  (via drill 0.3 pad 0.5)
  Top 0.152: J18.65 78.37,37.93 v78.36,37.95 | J3.49 35.37,11.14 36.35,12.12 36.35,21.54 42.28,27.48 54.81,27.48 55.57,28.24 v68.07,28.24 79.94,28.24 87.45,20.72 87.45,5.71 88.05,5.12 112.7,5.12 115.67,8.1 117.66,8.1 R8.1
  Bottom 0.152: v78.36,37.95 72.87,37.95 68.03,33.11 68.03,28.28 v68.07,28.24
LED_BLUE1
  Top 0.152: RGB.BLUE 117.39,9.96 118.14,9.21 R8.2
LED_GREEN  (via drill 0.3 pad 0.5)
  Top 0.152: J18.63 79.48,38.43 v79.46,38.45 | J3.47 37.91,11.04 39.11,12.23 39.11,22.1 43.49,26.48 54.53,26.48 55.68,27.63 v67.31,27.63 67.33,27.61 79.62,27.61 87.02,20.2 87.02,5.33 87.89,4.46 113.05,4.46 116.2,7.61 R19.1
  Bottom 0.152: v79.46,38.45 79.44,38.43 72.8,38.43 67.31,32.95 v67.31,27.64 v67.31,27.63
LED_GREEN1
  Top 0.152: RGB.GREEN 116.55,11.95 116.26,11.65 116.26,10.08 116.87,9.47 R19.2
LED_RED  (via drill 0.3 pad 0.5, 0.35)